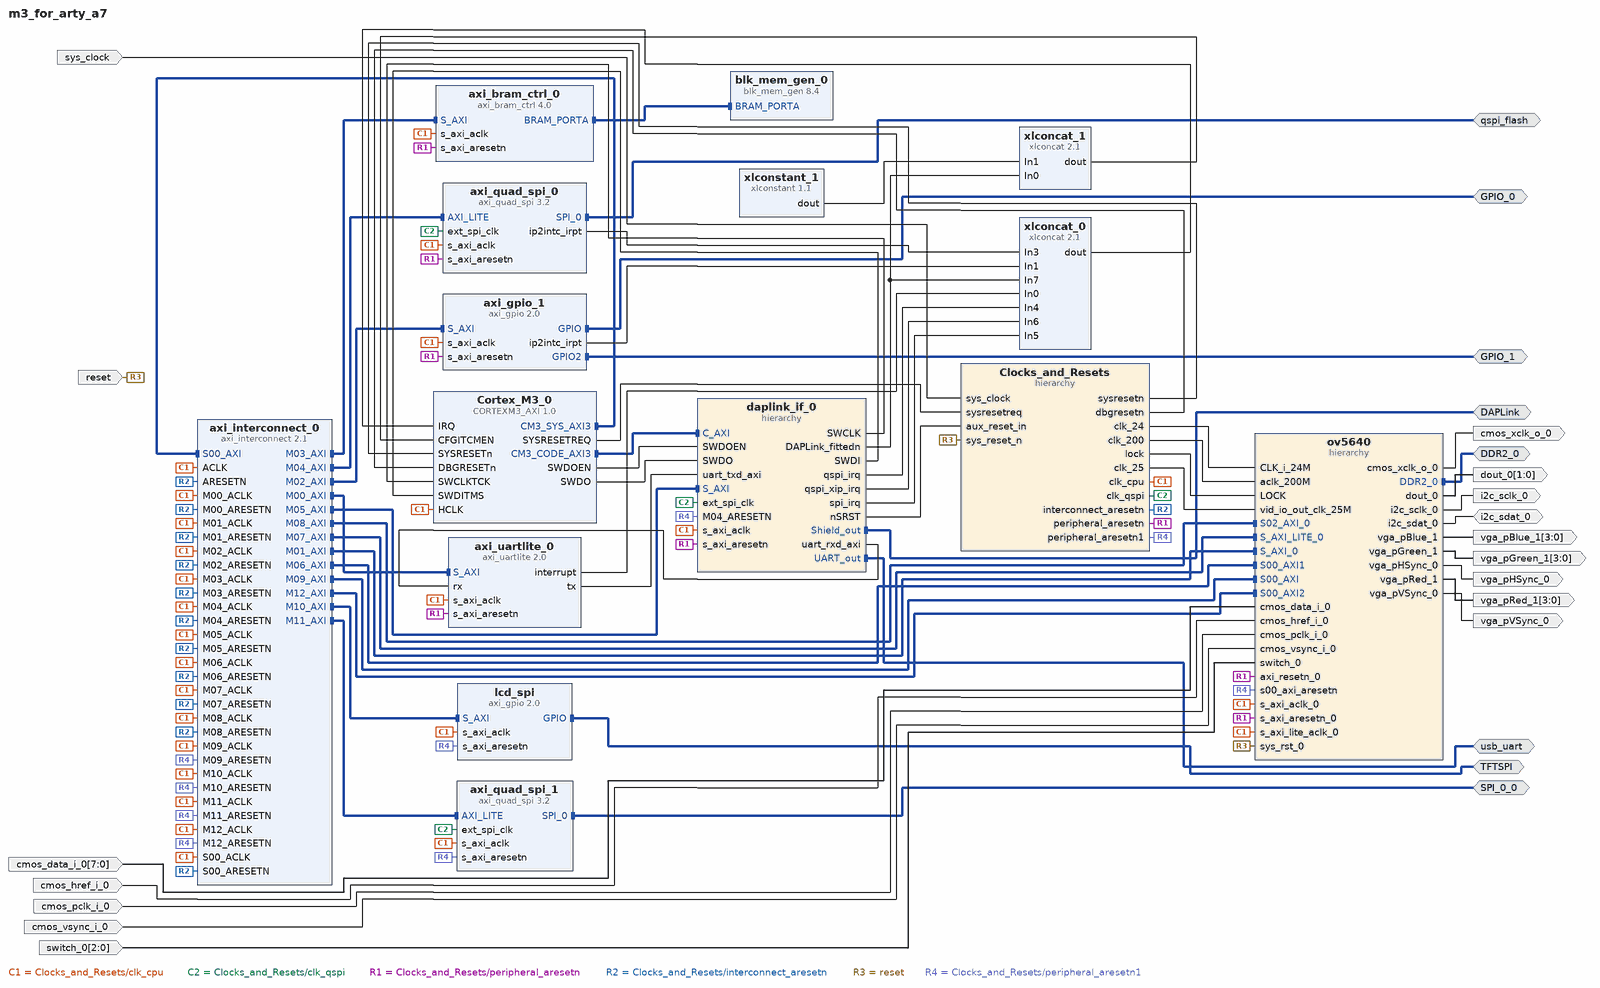
[diagram p0: block diagram of the top level]
# Vivado block design m3_for_arty_a7, xc7a100tcsg324-1, Vivado 2018.2
create_bd_design m3_for_arty_a7

create_bd_intf_port -mode Master -vlnv xilinx.com:interface:gpio_rtl:1.0 DAPLink
create_bd_intf_port -mode Master -vlnv xilinx.com:interface:spi_rtl:1.0 qspi_flash
create_bd_intf_port -mode Master -vlnv xilinx.com:interface:uart_rtl:1.0 usb_uart
create_bd_intf_port -mode Master -vlnv xilinx.com:interface:ddrx_rtl:1.0 DDR2_0
create_bd_intf_port -mode Master -vlnv xilinx.com:interface:gpio_rtl:1.0 GPIO_0
create_bd_intf_port -mode Master -vlnv xilinx.com:interface:gpio_rtl:1.0 GPIO_1
create_bd_intf_port -mode Master -vlnv xilinx.com:interface:gpio_rtl:1.0 TFTSPI
create_bd_intf_port -mode Master -vlnv xilinx.com:interface:spi_rtl:1.0 SPI_0_0
create_bd_port -dir I -type clk sys_clock
set_property -dict {CONFIG.FREQ_HZ 100000000 CONFIG.PHASE 0.000} [get_bd_ports sys_clock]
create_bd_port -dir I -type rst reset
set_property -dict {CONFIG.POLARITY ACTIVE_LOW} [get_bd_ports reset]
create_bd_port -dir O cmos_xclk_o_0
create_bd_port -dir I -from 7 -to 0 cmos_data_i_0
create_bd_port -dir I cmos_href_i_0
create_bd_port -dir I cmos_pclk_i_0
create_bd_port -dir I cmos_vsync_i_0
create_bd_port -dir O vga_pHSync_0
create_bd_port -dir O vga_pVSync_0
create_bd_port -dir O -from 3 -to 0 vga_pRed_1
create_bd_port -dir O -from 3 -to 0 vga_pGreen_1
create_bd_port -dir O -from 3 -to 0 vga_pBlue_1
create_bd_port -dir O -from 1 -to 0 dout_0
create_bd_port -dir O i2c_sclk_0
create_bd_port -dir IO i2c_sdat_0
create_bd_port -dir I -from 2 -to 0 switch_0

create_bd_cell -type hier Clocks_and_Resets
create_bd_cell -type ip -vlnv xilinx.com:ip:axi_bram_ctrl:4.0 axi_bram_ctrl_0
set_property -dict {CONFIG.PROTOCOL AXI4LITE CONFIG.SINGLE_PORT_BRAM 1 CONFIG.C_SELECT_XPM 0} [get_bd_cells axi_bram_ctrl_0]
create_bd_cell -type ip -vlnv xilinx.com:ip:axi_gpio:2.0 axi_gpio_1
set_property -dict [list \
  CONFIG.C_GPIO_WIDTH 8 \
  CONFIG.C_GPIO2_WIDTH 8 \
  CONFIG.C_IS_DUAL 1 \
  CONFIG.C_ALL_INPUTS_2 1 \
  CONFIG.C_INTERRUPT_PRESENT 1 \
  CONFIG.USE_BOARD_FLOW true \
  CONFIG.GPIO_BOARD_INTERFACE Custom \
  CONFIG.GPIO2_BOARD_INTERFACE Custom \
  CONFIG.C_ALL_OUTPUTS 1 \
] [get_bd_cells axi_gpio_1]
create_bd_cell -type ip -vlnv xilinx.com:ip:axi_interconnect:2.1 axi_interconnect_0
set_property -dict [list \
  CONFIG.NUM_SI 1 \
  CONFIG.NUM_MI 13 \
  CONFIG.ENABLE_ADVANCED_OPTIONS 1 \
  CONFIG.SYNCHRONIZATION_STAGES 2 \
  CONFIG.M00_HAS_REGSLICE 0 \
  CONFIG.M01_HAS_REGSLICE 3 \
  CONFIG.M02_HAS_REGSLICE 3 \
  CONFIG.M03_HAS_REGSLICE 3 \
  CONFIG.M04_HAS_REGSLICE 3 \
  CONFIG.M05_HAS_REGSLICE 3 \
  CONFIG.M00_HAS_DATA_FIFO 0 \
  CONFIG.M01_HAS_DATA_FIFO 0 \
  CONFIG.S00_HAS_REGSLICE 3 \
  CONFIG.S01_HAS_REGSLICE 3 \
  CONFIG.S01_HAS_DATA_FIFO 1 \
  CONFIG.M00_SECURE 0 \
  CONFIG.M01_SECURE 0 \
  CONFIG.M02_SECURE 0 \
] [get_bd_cells axi_interconnect_0]
create_bd_cell -type ip -vlnv xilinx.com:ip:axi_quad_spi:3.2 axi_quad_spi_0
set_property -dict [list \
  CONFIG.C_FIFO_DEPTH 16 \
  CONFIG.USE_BOARD_FLOW true \
  CONFIG.QSPI_BOARD_INTERFACE qspi_flash \
] [get_bd_cells axi_quad_spi_0]
create_bd_cell -type ip -vlnv xilinx.com:ip:axi_uartlite:2.0 axi_uartlite_0
set_property -dict [list \
  CONFIG.C_BAUDRATE 115200 \
  CONFIG.C_S_AXI_ACLK_FREQ_HZ 50000000 \
  CONFIG.USE_BOARD_FLOW true \
  CONFIG.UARTLITE_BOARD_INTERFACE Custom \
] [get_bd_cells axi_uartlite_0]
create_bd_cell -type ip -vlnv xilinx.com:ip:blk_mem_gen:8.4 blk_mem_gen_0
set_property -dict [list \
  CONFIG.Memory_Type Single_Port_RAM \
  CONFIG.Enable_32bit_Address true \
  CONFIG.Write_Width_A 32 \
  CONFIG.Read_Width_A 32 \
  CONFIG.Register_PortA_Output_of_Memory_Primitives false \
  CONFIG.Use_RSTA_Pin true \
  CONFIG.Port_A_Write_Rate 50 \
  CONFIG.Port_B_Clock 0 \
  CONFIG.Port_B_Write_Rate 0 \
  CONFIG.Port_B_Enable_Rate 0 \
  CONFIG.use_bram_block BRAM_Controller \
  CONFIG.EN_SAFETY_CKT true \
] [get_bd_cells blk_mem_gen_0]
create_bd_cell -type hier daplink_if_0
create_bd_cell -type ip -vlnv xilinx.com:ip:xlconcat:2.1 xlconcat_0
set_property -dict {CONFIG.NUM_PORTS 8} [get_bd_cells xlconcat_0]
create_bd_cell -type ip -vlnv xilinx.com:ip:xlconcat:2.1 xlconcat_1
set_property -dict {CONFIG.NUM_PORTS 2 CONFIG.IN6_WIDTH 25} [get_bd_cells xlconcat_1]
create_bd_cell -type ip -vlnv xilinx.com:ip:xlconstant:1.1 xlconstant_1
set_property -dict {CONFIG.CONST_WIDTH 1 CONFIG.CONST_VAL 1} [get_bd_cells xlconstant_1]
create_bd_cell -type ip -vlnv Arm.com:CortexM:CORTEXM3_AXI:1.0 Cortex_M3_0
set_property -dict [list \
  CONFIG.JTAG_PRESENT false \
  CONFIG.ITCM_SIZE {"0110"} \
  CONFIG.DTCM_SIZE {"0110"} \
  CONFIG.ITCM_INIT_FILE bram_a7.hex \
  CONFIG.TRACE_LVL 1 \
  CONFIG.DEBUG_LVL 2 \
  CONFIG.WIC_PRESENT false \
] [get_bd_cells Cortex_M3_0]
create_bd_cell -type hier ov5640
create_bd_cell -type ip -vlnv xilinx.com:ip:axi_gpio:2.0 lcd_spi
set_property -dict {CONFIG.C_GPIO_WIDTH 3 CONFIG.USE_BOARD_FLOW true CONFIG.GPIO_BOARD_INTERFACE Custom} [get_bd_cells lcd_spi]
create_bd_cell -type ip -vlnv xilinx.com:ip:axi_quad_spi:3.2 axi_quad_spi_1
set_property -dict [list \
  CONFIG.C_USE_STARTUP 0 \
  CONFIG.C_NUM_SS_BITS 2 \
  CONFIG.C_SCK_RATIO 16 \
  CONFIG.C_FIFO_DEPTH 16 \
  CONFIG.C_XIP_MODE 0 \
  CONFIG.C_TYPE_OF_AXI4_INTERFACE 0 \
  CONFIG.Master_mode 1 \
  CONFIG.FIFO_INCLUDED 1 \
] [get_bd_cells axi_quad_spi_1]

# ---- hierarchy /Clocks_and_Resets ----
current_bd_instance /Clocks_and_Resets
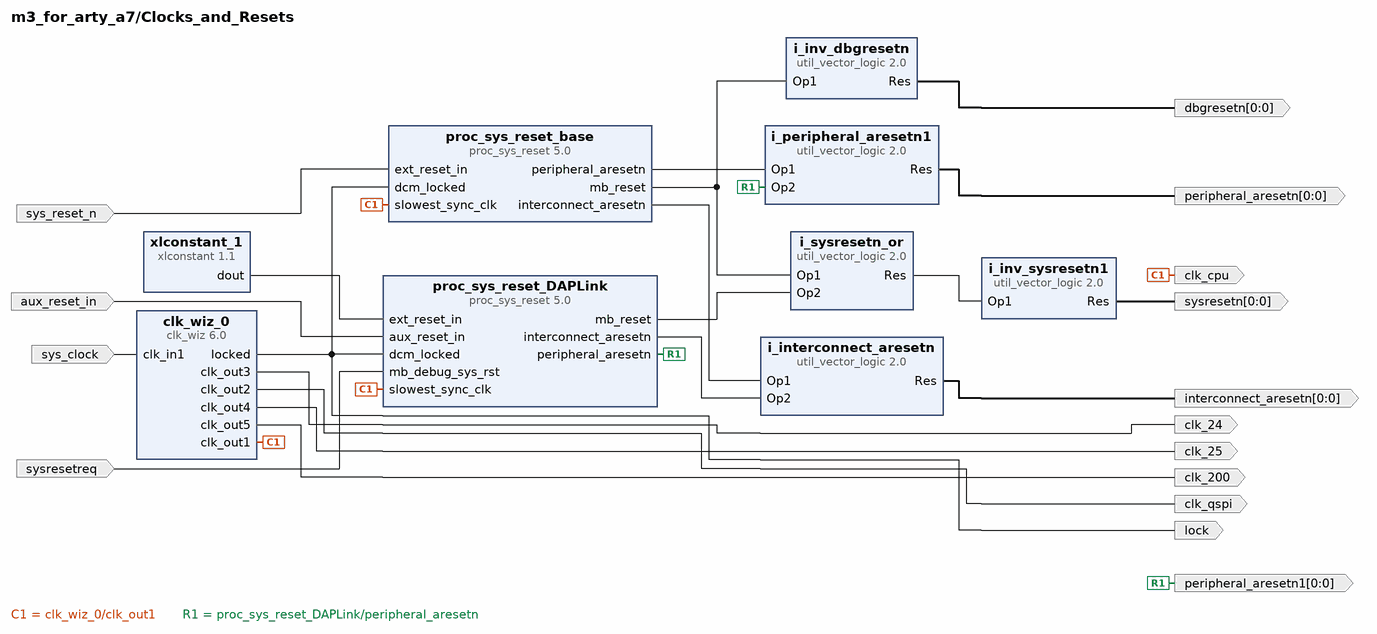
[diagram p1: block diagram inside /Clocks_and_Resets]
create_bd_pin -dir I -type rst aux_reset_in
create_bd_pin -dir O -from 0 -to 0 -type rst interconnect_aresetn
create_bd_pin -dir O -from 0 -to 0 -type rst peripheral_aresetn
create_bd_pin -dir O -type clk clk_cpu
create_bd_pin -dir I -type clk sys_clock
create_bd_pin -dir O -from 0 -to 0 sysresetn
create_bd_pin -dir O -from 0 -to 0 dbgresetn
create_bd_pin -dir O clk_qspi
create_bd_pin -dir I sysresetreq
create_bd_pin -dir I -type rst sys_reset_n
create_bd_pin -dir O -type clk clk_24
create_bd_pin -dir O -type clk clk_25
create_bd_pin -dir O -type clk clk_200
create_bd_pin -dir O lock
create_bd_pin -dir O -from 0 -to 0 -type rst peripheral_aresetn1

create_bd_cell -type ip -vlnv xilinx.com:ip:proc_sys_reset:5.0 proc_sys_reset_DAPLink
set_property -dict [list \
  CONFIG.C_AUX_RST_WIDTH 1 \
  CONFIG.C_EXT_RST_WIDTH 1 \
  CONFIG.USE_BOARD_FLOW true \
  CONFIG.RESET_BOARD_INTERFACE Custom \
] [get_bd_cells proc_sys_reset_DAPLink]
create_bd_cell -type ip -vlnv xilinx.com:ip:proc_sys_reset:5.0 proc_sys_reset_base
set_property -dict [list \
  CONFIG.C_AUX_RST_WIDTH 1 \
  CONFIG.C_EXT_RST_WIDTH 1 \
  CONFIG.USE_BOARD_FLOW true \
  CONFIG.RESET_BOARD_INTERFACE reset \
] [get_bd_cells proc_sys_reset_base]
create_bd_cell -type ip -vlnv xilinx.com:ip:util_vector_logic:2.0 i_interconnect_aresetn
set_property -dict {CONFIG.C_SIZE 1} [get_bd_cells i_interconnect_aresetn]
create_bd_cell -type ip -vlnv xilinx.com:ip:util_vector_logic:2.0 i_peripheral_aresetn1
set_property -dict {CONFIG.C_SIZE 1} [get_bd_cells i_peripheral_aresetn1]
create_bd_cell -type ip -vlnv xilinx.com:ip:util_vector_logic:2.0 i_sysresetn_or
set_property -dict {CONFIG.C_SIZE 1 CONFIG.C_OPERATION or} [get_bd_cells i_sysresetn_or]
create_bd_cell -type ip -vlnv xilinx.com:ip:util_vector_logic:2.0 i_inv_dbgresetn
set_property -dict {CONFIG.C_SIZE 1 CONFIG.C_OPERATION not} [get_bd_cells i_inv_dbgresetn]
create_bd_cell -type ip -vlnv xilinx.com:ip:util_vector_logic:2.0 i_inv_sysresetn1
set_property -dict {CONFIG.C_SIZE 1 CONFIG.C_OPERATION not} [get_bd_cells i_inv_sysresetn1]
create_bd_cell -type ip -vlnv xilinx.com:ip:clk_wiz:6.0 clk_wiz_0
set_property -dict [list \
  CONFIG.USE_INCLK_SWITCHOVER false \
  CONFIG.SECONDARY_SOURCE Single_ended_clock_capable_pin \
  CONFIG.CLKIN1_JITTER_PS 833.33 \
  CONFIG.CLKIN2_JITTER_PS 833.33 \
  CONFIG.CLKOUT2_USED true \
  CONFIG.CLKOUT3_USED true \
  CONFIG.CLKOUT4_USED true \
  CONFIG.CLKOUT5_USED true \
  CONFIG.NUM_OUT_CLKS 5 \
  CONFIG.CLKOUT1_REQUESTED_OUT_FREQ 50.0 \
  CONFIG.CLKOUT2_REQUESTED_OUT_FREQ 50.0 \
  CONFIG.CLKOUT3_REQUESTED_OUT_FREQ 24 \
  CONFIG.CLKOUT4_REQUESTED_OUT_FREQ 25 \
  CONFIG.CLKOUT5_REQUESTED_OUT_FREQ 200 \
  CONFIG.CLKOUT1_DRIVES BUFGCE \
  CONFIG.CLKOUT2_DRIVES BUFGCE \
  CONFIG.CLKOUT3_DRIVES BUFGCE \
  CONFIG.CLKOUT4_DRIVES BUFGCE \
  CONFIG.CLKOUT5_DRIVES BUFGCE \
  CONFIG.CLKOUT6_DRIVES BUFGCE \
  CONFIG.CLKOUT7_DRIVES BUFGCE \
  CONFIG.FEEDBACK_SOURCE FDBK_AUTO \
  CONFIG.USE_RESET false \
  CONFIG.MMCM_DIVCLK_DIVIDE 1 \
  CONFIG.MMCM_CLKFBOUT_MULT_F 6.000 \
  CONFIG.MMCM_CLKIN1_PERIOD 10.0 \
  CONFIG.MMCM_CLKIN2_PERIOD 10.0 \
  CONFIG.MMCM_CLKOUT0_DIVIDE_F 12.000 \
  CONFIG.MMCM_CLKOUT1_DIVIDE 12 \
  CONFIG.MMCM_CLKOUT2_DIVIDE 25 \
  CONFIG.MMCM_CLKOUT3_DIVIDE 24 \
  CONFIG.MMCM_CLKOUT4_DIVIDE 3 \
  CONFIG.USE_SAFE_CLOCK_STARTUP true \
  CONFIG.USE_BOARD_FLOW true \
  CONFIG.CLK_IN1_BOARD_INTERFACE sys_clock \
  CONFIG.CLK_IN2_BOARD_INTERFACE Custom \
  CONFIG.RESET_BOARD_INTERFACE Custom \
  CONFIG.CLKOUT1_JITTER 174.353 \
  CONFIG.CLKOUT1_PHASE_ERROR 132.063 \
  CONFIG.CLKOUT2_JITTER 174.353 \
  CONFIG.CLKOUT2_PHASE_ERROR 132.063 \
  CONFIG.CLKOUT3_JITTER 202.114 \
  CONFIG.CLKOUT3_PHASE_ERROR 132.063 \
  CONFIG.CLKOUT4_JITTER 200.470 \
  CONFIG.CLKOUT4_PHASE_ERROR 132.063 \
  CONFIG.CLKOUT5_JITTER 132.221 \
  CONFIG.CLKOUT5_PHASE_ERROR 132.063 \
] [get_bd_cells clk_wiz_0]
create_bd_cell -type ip -vlnv xilinx.com:ip:xlconstant:1.1 xlconstant_1

# ---- hierarchy /daplink_if_0 ----
current_bd_instance /daplink_if_0
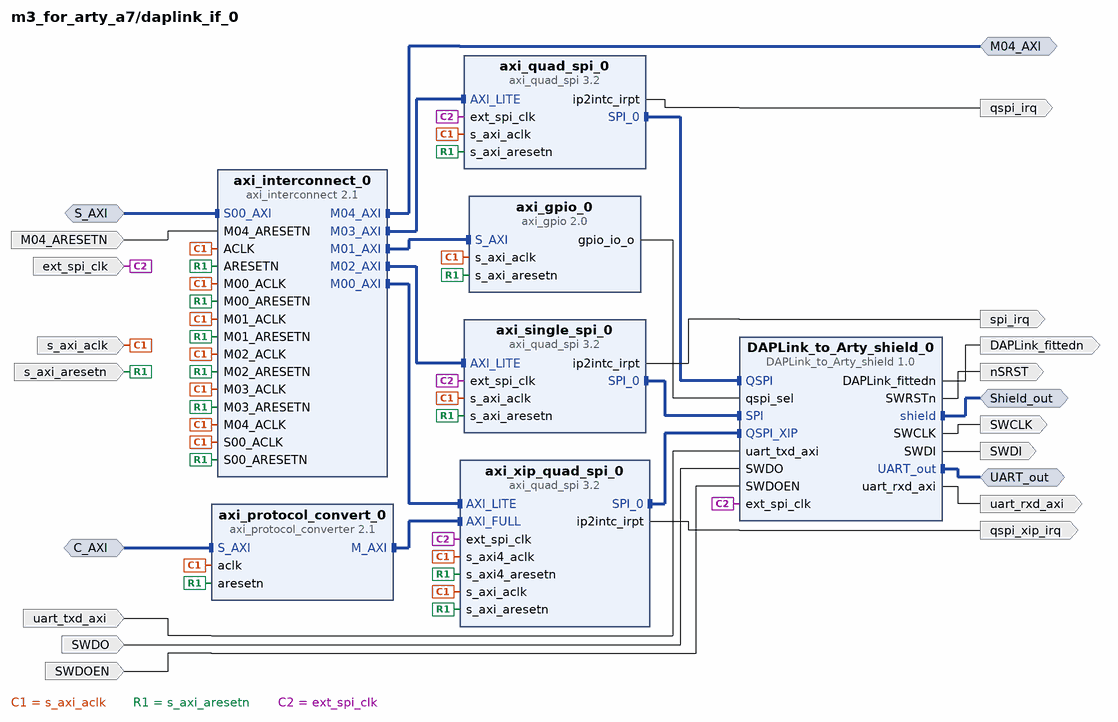
[diagram p2: block diagram inside /daplink_if_0]
create_bd_intf_pin -mode Slave -vlnv xilinx.com:interface:aximm_rtl:1.0 S_AXI
create_bd_intf_pin -mode Master -vlnv xilinx.com:interface:uart_rtl:1.0 UART_out
create_bd_intf_pin -mode Master -vlnv xilinx.com:interface:gpio_rtl:1.0 Shield_out
create_bd_intf_pin -mode Slave -vlnv xilinx.com:interface:aximm_rtl:1.0 C_AXI
create_bd_intf_pin -mode Master -vlnv xilinx.com:interface:aximm_rtl:1.0 M04_AXI
create_bd_pin -dir I s_axi_aclk
create_bd_pin -dir I s_axi_aresetn
create_bd_pin -dir O DAPLink_fittedn
create_bd_pin -dir O qspi_irq
create_bd_pin -dir I ext_spi_clk
create_bd_pin -dir O uart_rxd_axi
create_bd_pin -dir O SWDI
create_bd_pin -dir O SWCLK
create_bd_pin -dir O nSRST
create_bd_pin -dir I SWDOEN
create_bd_pin -dir I SWDO
create_bd_pin -dir I uart_txd_axi
create_bd_pin -dir O spi_irq
create_bd_pin -dir O qspi_xip_irq
create_bd_pin -dir I -type rst M04_ARESETN

create_bd_cell -type ip -vlnv xilinx.com:ip:axi_interconnect:2.1 axi_interconnect_0
set_property -dict {CONFIG.NUM_MI 5} [get_bd_cells axi_interconnect_0]
create_bd_cell -type ip -vlnv xilinx.com:ip:axi_quad_spi:3.2 axi_single_spi_0
set_property -dict {CONFIG.C_USE_STARTUP 0 CONFIG.C_FIFO_DEPTH 16} [get_bd_cells axi_single_spi_0]
create_bd_cell -type ip -vlnv xilinx.com:ip:axi_quad_spi:3.2 axi_quad_spi_0
set_property -dict {CONFIG.C_USE_STARTUP 0 CONFIG.C_SPI_MODE 2 CONFIG.C_FIFO_DEPTH 16} [get_bd_cells axi_quad_spi_0]
create_bd_cell -type ip -vlnv xilinx.com:ip:axi_quad_spi:3.2 axi_xip_quad_spi_0
set_property -dict [list \
  CONFIG.C_SPI_MEMORY 3 \
  CONFIG.C_USE_STARTUP 0 \
  CONFIG.C_SPI_MODE 2 \
  CONFIG.C_XIP_MODE 1 \
  CONFIG.C_SPI_MEM_ADDR_BITS 24 \
  CONFIG.C_TYPE_OF_AXI4_INTERFACE 1 \
] [get_bd_cells axi_xip_quad_spi_0]
create_bd_cell -type ip -vlnv xilinx.com:ip:axi_gpio:2.0 axi_gpio_0
create_bd_cell -type ip -vlnv xilinx.com:ip:axi_protocol_converter:2.1 axi_protocol_convert_0
create_bd_cell -type ip -vlnv Arm.com:user:DAPLink_to_Arty_shield:1.0 DAPLink_to_Arty_shield_0

# ---- hierarchy /ov5640 ----
current_bd_instance /ov5640
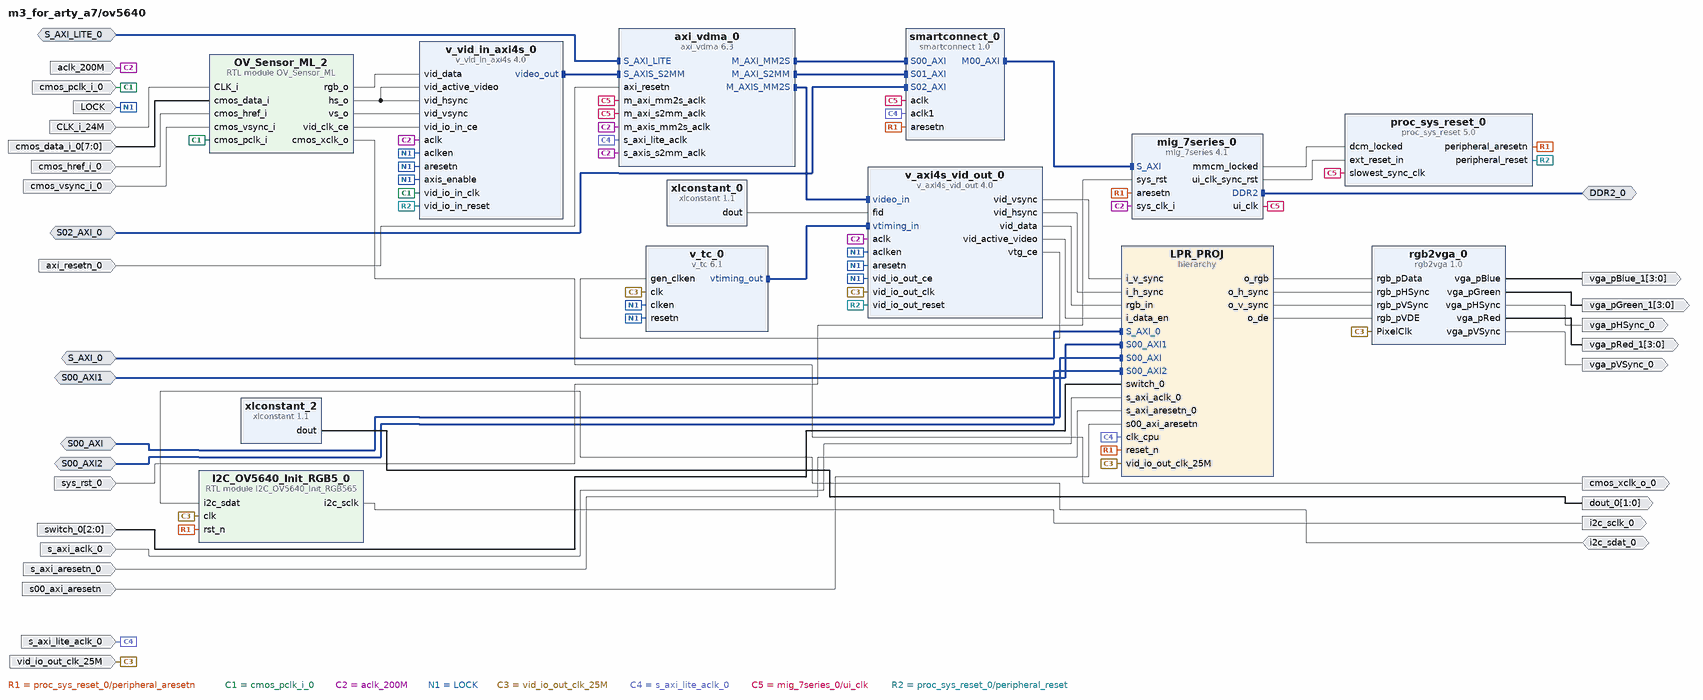
[diagram p3: block diagram inside /ov5640]
create_bd_intf_pin -mode Slave -vlnv xilinx.com:interface:aximm_rtl:1.0 S_AXI_LITE_0
create_bd_intf_pin -mode Master -vlnv xilinx.com:interface:ddrx_rtl:1.0 DDR2_0
create_bd_intf_pin -mode Slave -vlnv xilinx.com:interface:aximm_rtl:1.0 S02_AXI_0
create_bd_intf_pin -mode Slave -vlnv xilinx.com:interface:aximm_rtl:1.0 S_AXI_0
create_bd_intf_pin -mode Slave -vlnv xilinx.com:interface:aximm_rtl:1.0 S00_AXI1
create_bd_intf_pin -mode Slave -vlnv xilinx.com:interface:aximm_rtl:1.0 S00_AXI
create_bd_intf_pin -mode Slave -vlnv xilinx.com:interface:aximm_rtl:1.0 S00_AXI2
create_bd_pin -dir O cmos_xclk_o_0
create_bd_pin -dir I CLK_i_24M
create_bd_pin -dir I -from 7 -to 0 cmos_data_i_0
create_bd_pin -dir I cmos_href_i_0
create_bd_pin -dir I cmos_pclk_i_0
create_bd_pin -dir I cmos_vsync_i_0
create_bd_pin -dir I LOCK
create_bd_pin -dir I -type clk aclk_200M
create_bd_pin -dir I -type rst axi_resetn_0
create_bd_pin -dir I -type clk vid_io_out_clk_25M
create_bd_pin -dir I -type clk s_axi_lite_aclk_0
create_bd_pin -dir O vga_pHSync_0
create_bd_pin -dir O vga_pVSync_0
create_bd_pin -dir O -from 3 -to 0 vga_pRed_1
create_bd_pin -dir O -from 3 -to 0 vga_pGreen_1
create_bd_pin -dir O -from 3 -to 0 vga_pBlue_1
create_bd_pin -dir O -from 1 -to 0 dout_0
create_bd_pin -dir I -type rst sys_rst_0
create_bd_pin -dir O i2c_sclk_0
create_bd_pin -dir IO i2c_sdat_0
create_bd_pin -dir I -from 2 -to 0 switch_0
create_bd_pin -dir I -type clk s_axi_aclk_0
create_bd_pin -dir I -type rst s_axi_aresetn_0
create_bd_pin -dir I -type rst s00_axi_aresetn

create_bd_cell -type ip -vlnv xilinx.com:ip:v_vid_in_axi4s:4.0 v_vid_in_axi4s_0
set_property -dict {CONFIG.C_HAS_ASYNC_CLK 1} [get_bd_cells v_vid_in_axi4s_0]
create_bd_cell -type ip -vlnv xilinx.com:ip:v_axi4s_vid_out:4.0 v_axi4s_vid_out_0
set_property -dict {CONFIG.C_HAS_ASYNC_CLK 1} [get_bd_cells v_axi4s_vid_out_0]
create_bd_cell -type ip -vlnv xilinx.com:ip:axi_vdma:6.3 axi_vdma_0
set_property -dict {CONFIG.c_m_axis_mm2s_tdata_width 24} [get_bd_cells axi_vdma_0]
create_bd_cell -type ip -vlnv xilinx.com:ip:v_tc:6.1 v_tc_0
set_property -dict [list \
  CONFIG.HAS_AXI4_LITE false \
  CONFIG.HAS_INTC_IF false \
  CONFIG.VIDEO_MODE 640x480p \
  CONFIG.enable_detection false \
  CONFIG.enable_generation true \
] [get_bd_cells v_tc_0]
create_bd_cell -type ip -vlnv xilinx.com:ip:xlconstant:1.1 xlconstant_0
set_property -dict {CONFIG.CONST_VAL 0} [get_bd_cells xlconstant_0]
create_bd_cell -type ip -vlnv xilinx.com:ip:proc_sys_reset:5.0 proc_sys_reset_0
create_bd_cell -type ip -vlnv digilentinc.com:ip:rgb2vga:1.0 rgb2vga_0
set_property -dict [list \
  CONFIG.kBlueDepth 4 \
  CONFIG.kGreenDepth 4 \
  CONFIG.kRedDepth 4 \
  CONFIG.VID_IN_DATA_WIDTH 24 \
] [get_bd_cells rgb2vga_0]
create_bd_cell -type ip -vlnv xilinx.com:ip:mig_7series:4.1 mig_7series_0
set_property -dict [list \
  CONFIG.XML_INPUT_FILE mig_a.prj \
  CONFIG.RESET_BOARD_INTERFACE Custom \
  CONFIG.MIG_DONT_TOUCH_PARAM Custom \
  CONFIG.BOARD_MIG_PARAM Custom \
] [get_bd_cells mig_7series_0]
create_bd_cell -type ip -vlnv xilinx.com:ip:xlconstant:1.1 xlconstant_2
set_property -dict {CONFIG.CONST_WIDTH 2 CONFIG.CONST_VAL 2} [get_bd_cells xlconstant_2]
create_bd_cell -type module -reference OV_Sensor_ML OV_Sensor_ML_2
create_bd_cell -type module -reference I2C_OV5640_Init_RGB565 I2C_OV5640_Init_RGB5_0
set_property -dict {CONFIG.CLK_Freq 250000000} [get_bd_cells I2C_OV5640_Init_RGB5_0]
create_bd_cell -type hier LPR_PROJ
create_bd_cell -type ip -vlnv xilinx.com:ip:smartconnect:1.0 smartconnect_0
set_property -dict {CONFIG.NUM_SI 3 CONFIG.NUM_CLKS 2 CONFIG.HAS_ARESETN 1} [get_bd_cells smartconnect_0]

# ---- hierarchy /ov5640/LPR_PROJ ----
current_bd_instance /ov5640/LPR_PROJ
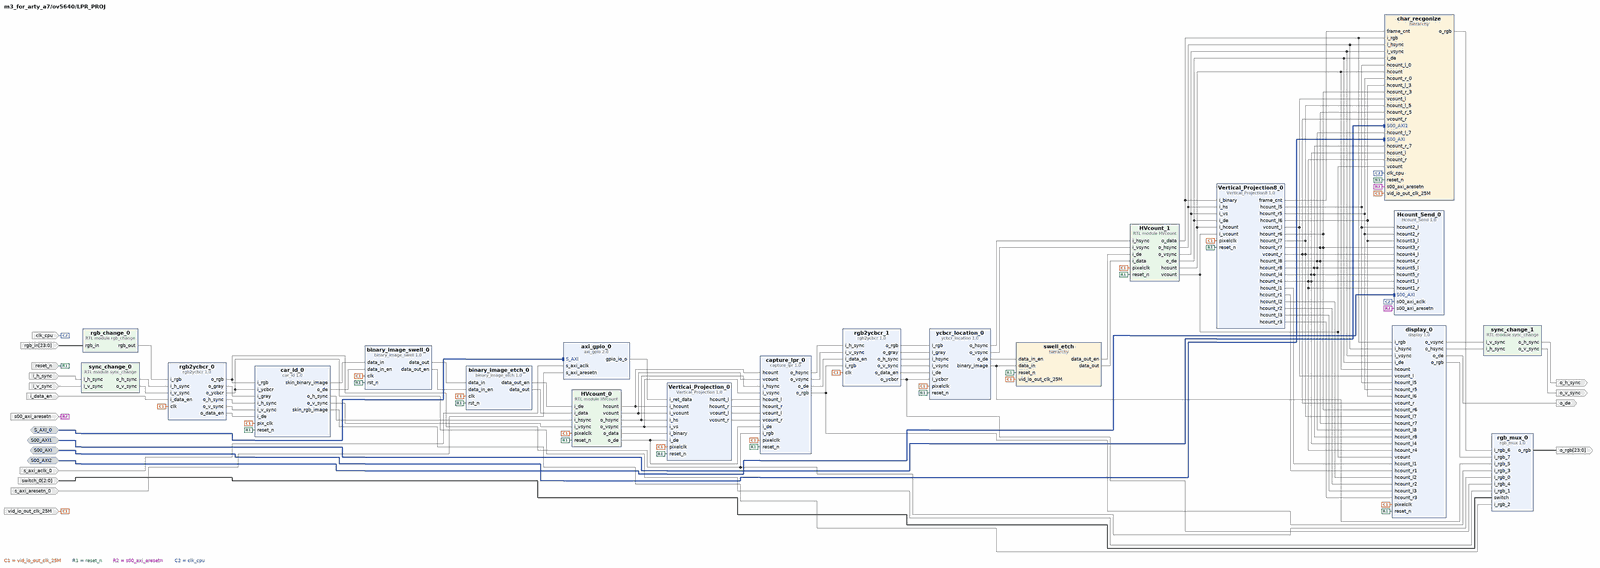
[diagram p4: block diagram inside /ov5640/LPR_PROJ, whole]
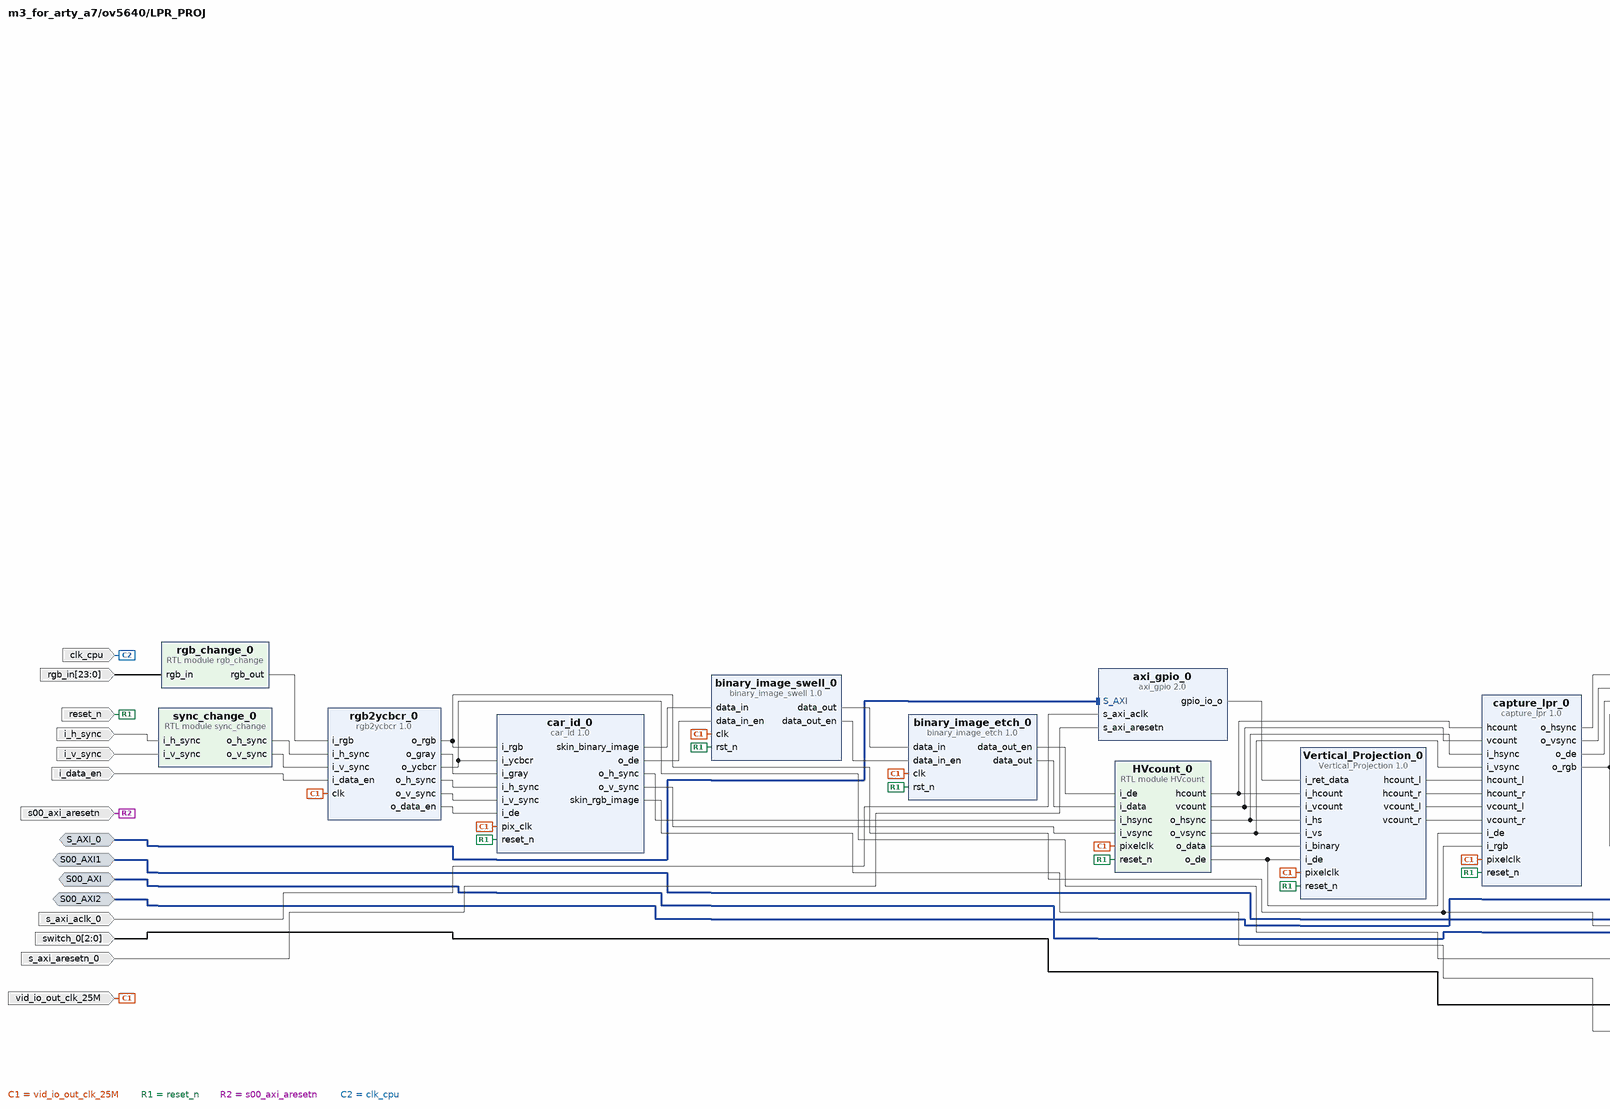
[diagram p5: block diagram inside /ov5640/LPR_PROJ, left part]
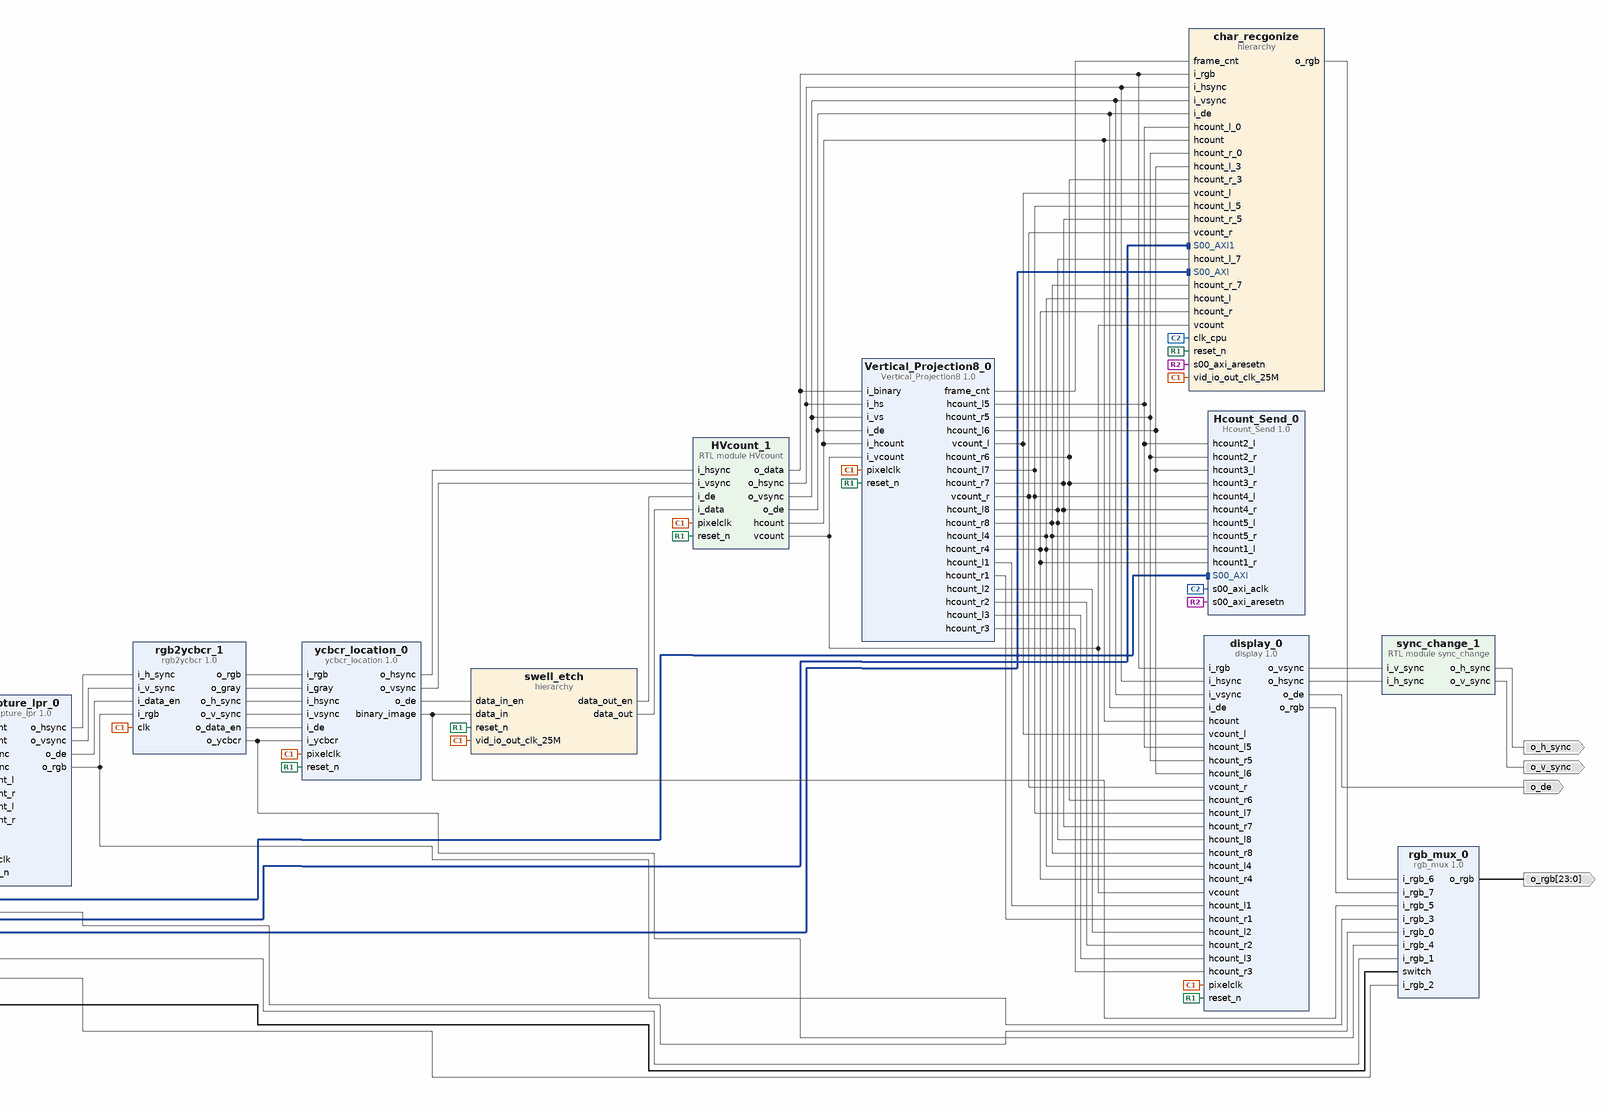
[diagram p6: block diagram inside /ov5640/LPR_PROJ, right part]
create_bd_intf_pin -mode Slave -vlnv xilinx.com:interface:aximm_rtl:1.0 S_AXI_0
create_bd_intf_pin -mode Slave -vlnv xilinx.com:interface:aximm_rtl:1.0 S00_AXI1
create_bd_intf_pin -mode Slave -vlnv xilinx.com:interface:aximm_rtl:1.0 S00_AXI
create_bd_intf_pin -mode Slave -vlnv xilinx.com:interface:aximm_rtl:1.0 S00_AXI2
create_bd_pin -dir I i_data_en
create_bd_pin -dir I -from 23 -to 0 rgb_in
create_bd_pin -dir I i_h_sync
create_bd_pin -dir I i_v_sync
create_bd_pin -dir O -from 23 -to 0 o_rgb
create_bd_pin -dir O o_h_sync
create_bd_pin -dir O o_v_sync
create_bd_pin -dir O o_de
create_bd_pin -dir I vid_io_out_clk_25M
create_bd_pin -dir I -type rst reset_n
create_bd_pin -dir I -from 2 -to 0 switch_0
create_bd_pin -dir I -type clk s_axi_aclk_0
create_bd_pin -dir I -type rst s_axi_aresetn_0
create_bd_pin -dir I -type clk clk_cpu
create_bd_pin -dir I -type rst s00_axi_aresetn

create_bd_cell -type module -reference rgb_change rgb_change_0
create_bd_cell -type module -reference sync_change sync_change_0
create_bd_cell -type module -reference HVcount HVcount_0
create_bd_cell -type ip -vlnv xilinx.com:user:rgb2ycbcr:1.0 rgb2ycbcr_0
create_bd_cell -type ip -vlnv xilinx.com:user:car_id:1.0 car_id_0
set_property -dict [list \
  CONFIG.CB_LOW {"01011010"} \
  CONFIG.CB_HIGH {"11100110"} \
  CONFIG.CR_LOW 00000100 \
  CONFIG.CR_HIGH {"10101010"} \
] [get_bd_cells car_id_0]
create_bd_cell -type ip -vlnv xilinx.com:user:capture_lpr:1.0 capture_lpr_0
create_bd_cell -type ip -vlnv xilinx.com:user:rgb2ycbcr:1.0 rgb2ycbcr_1
create_bd_cell -type ip -vlnv xilinx.com:user:ycbcr_location:1.0 ycbcr_location_0
set_property -dict {CONFIG.CB_LOW 100 CONFIG.CB_HIGH 220 CONFIG.CR_LOW 100 CONFIG.CR_HIGH 165} [get_bd_cells ycbcr_location_0]
create_bd_cell -type ip -vlnv xilinx.com:user:display:1.0 display_0
create_bd_cell -type ip -vlnv xilinx.com:user:rgb_mux:1.0 rgb_mux_0
create_bd_cell -type module -reference sync_change sync_change_1
create_bd_cell -type ip -vlnv xilinx.com:ip:axi_gpio:2.0 axi_gpio_0
set_property -dict {CONFIG.C_IS_DUAL 0 CONFIG.C_ALL_OUTPUTS 1} [get_bd_cells axi_gpio_0]
create_bd_cell -type ip -vlnv xilinx.com:user:Vertical_Projection8:1.0 Vertical_Projection8_0
create_bd_cell -type hier char_recgonize
create_bd_cell -type module -reference HVcount HVcount_1
create_bd_cell -type hier swell_etch
create_bd_cell -type ip -vlnv xilinx.com:user:Hcount_Send:1.0 Hcount_Send_0
create_bd_cell -type ip -vlnv xilinx.com:user:binary_image_swell:1.0 binary_image_swell_0
create_bd_cell -type ip -vlnv xilinx.com:user:binary_image_etch:1.0 binary_image_etch_0
create_bd_cell -type ip -vlnv xilinx.com:user:Vertical_Projection:1.0 Vertical_Projection_0

# ---- hierarchy /ov5640/LPR_PROJ/char_recgonize ----
current_bd_instance /ov5640/LPR_PROJ/char_recgonize
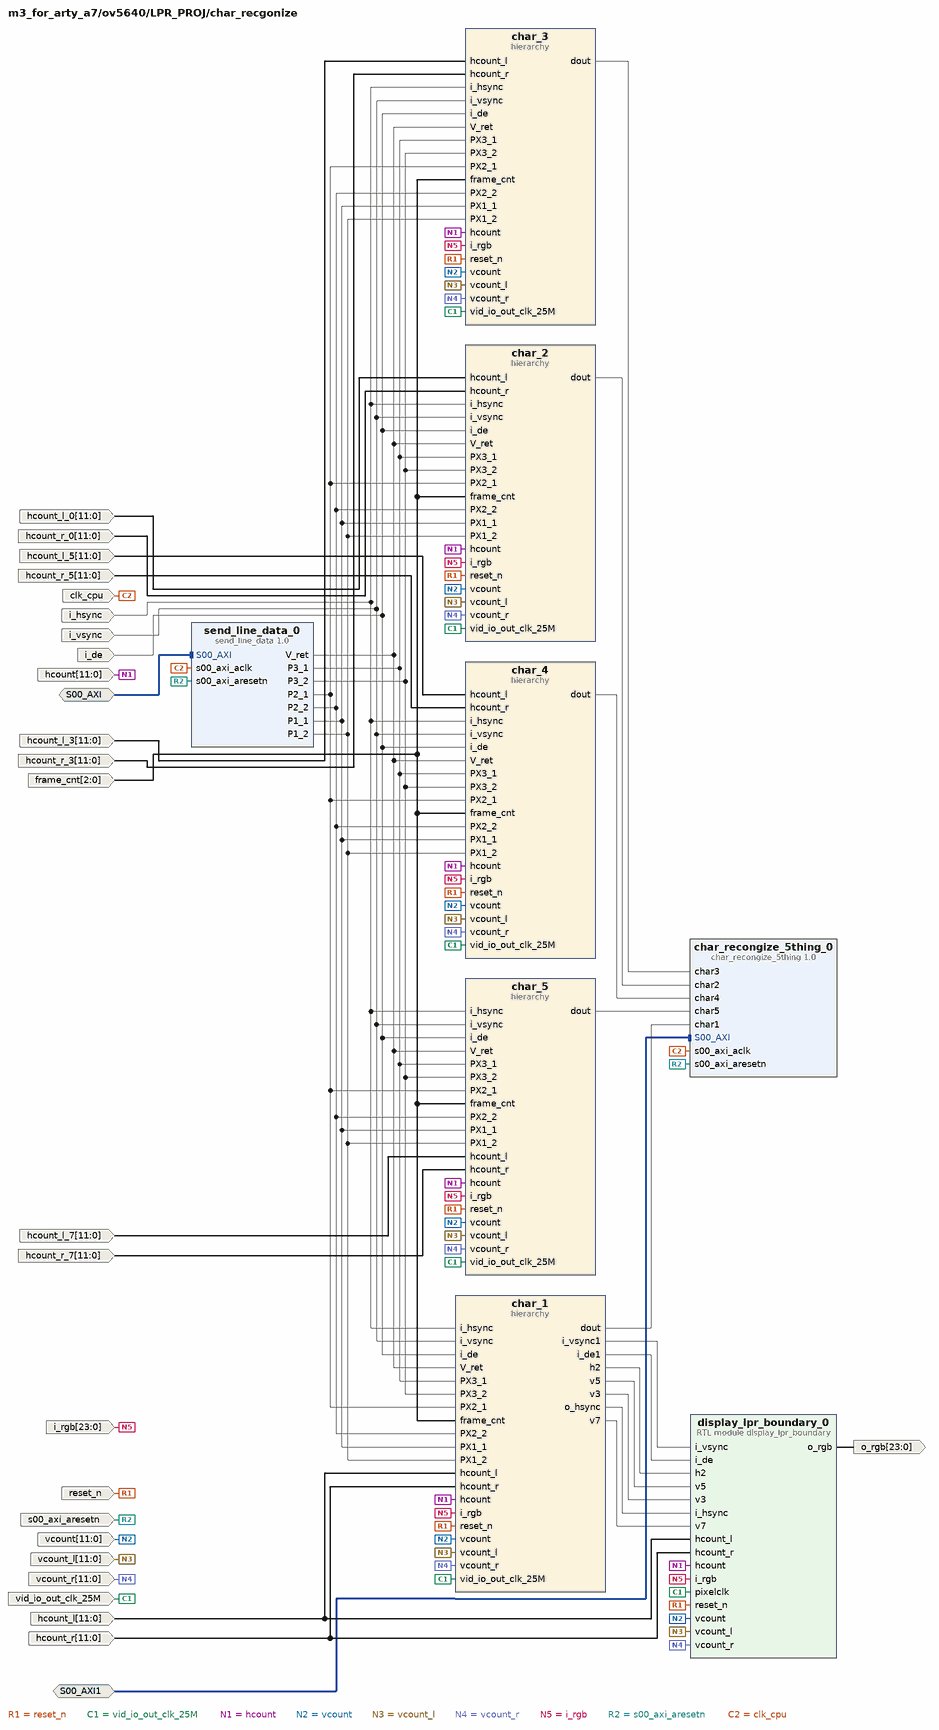
[diagram p7: block diagram inside /ov5640/LPR_PROJ/char_recgonize]
create_bd_intf_pin -mode Slave -vlnv xilinx.com:interface:aximm_rtl:1.0 S00_AXI1
create_bd_intf_pin -mode Slave -vlnv xilinx.com:interface:aximm_rtl:1.0 S00_AXI
create_bd_pin -dir I vid_io_out_clk_25M
create_bd_pin -dir I -type rst reset_n
create_bd_pin -dir I -from 23 -to 0 i_rgb
create_bd_pin -dir I -from 2 -to 0 frame_cnt
create_bd_pin -dir I i_hsync
create_bd_pin -dir I i_vsync
create_bd_pin -dir I i_de
create_bd_pin -dir I -from 11 -to 0 hcount
create_bd_pin -dir I -from 11 -to 0 vcount
create_bd_pin -dir I -from 11 -to 0 hcount_l
create_bd_pin -dir I -from 11 -to 0 hcount_r
create_bd_pin -dir I -from 11 -to 0 vcount_l
create_bd_pin -dir I -from 11 -to 0 vcount_r
create_bd_pin -dir I -type rst s00_axi_aresetn
create_bd_pin -dir I -type clk clk_cpu
create_bd_pin -dir O -from 23 -to 0 o_rgb
create_bd_pin -dir I -from 11 -to 0 hcount_l_0
create_bd_pin -dir I -from 11 -to 0 hcount_r_0
create_bd_pin -dir I -from 11 -to 0 hcount_l_3
create_bd_pin -dir I -from 11 -to 0 hcount_r_3
create_bd_pin -dir I -from 11 -to 0 hcount_l_5
create_bd_pin -dir I -from 11 -to 0 hcount_r_5
create_bd_pin -dir I -from 11 -to 0 hcount_l_7
create_bd_pin -dir I -from 11 -to 0 hcount_r_7

create_bd_cell -type hier char_1
create_bd_cell -type hier char_2
create_bd_cell -type hier char_3
create_bd_cell -type hier char_4
create_bd_cell -type hier char_5
create_bd_cell -type ip -vlnv xilinx.com:user:send_line_data:1.0 send_line_data_0
create_bd_cell -type ip -vlnv xilinx.com:user:char_recongize_5thing:1.0 char_recongize_5thing_0
create_bd_cell -type module -reference display_lpr_boundary display_lpr_boundary_0

# ---- hierarchy /ov5640/LPR_PROJ/char_recgonize/char_1 ----
current_bd_instance /ov5640/LPR_PROJ/char_recgonize/char_1
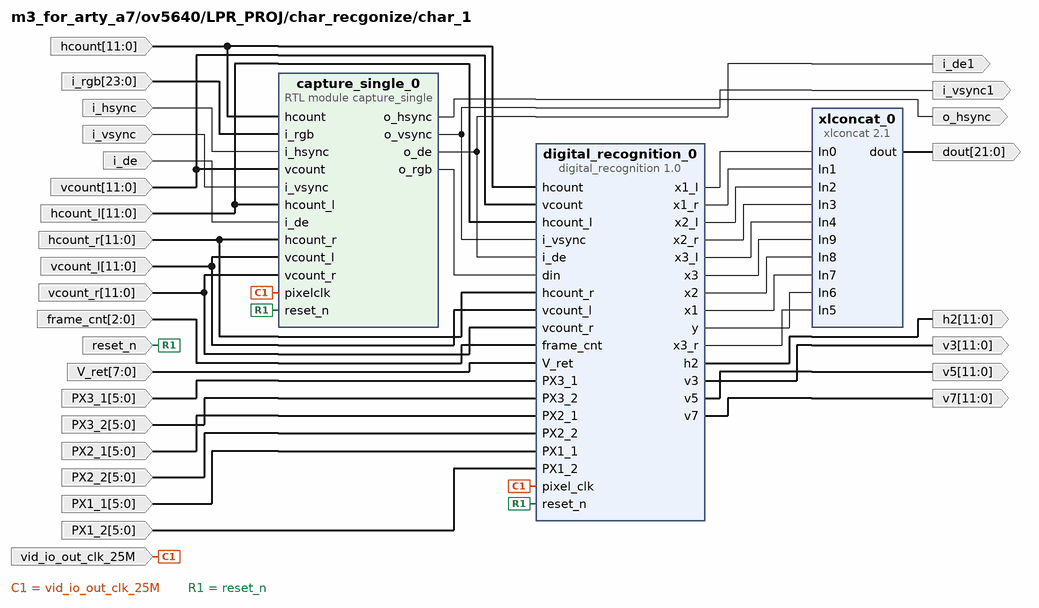
[diagram p8: block diagram inside /ov5640/LPR_PROJ/char_recgonize/char_1]
create_bd_pin -dir I -type clk vid_io_out_clk_25M
create_bd_pin -dir I -type rst reset_n
create_bd_pin -dir I -from 23 -to 0 i_rgb
create_bd_pin -dir I i_hsync
create_bd_pin -dir I i_vsync
create_bd_pin -dir I i_de
create_bd_pin -dir I -from 11 -to 0 hcount
create_bd_pin -dir I -from 11 -to 0 vcount
create_bd_pin -dir I -from 11 -to 0 hcount_l
create_bd_pin -dir I -from 11 -to 0 hcount_r
create_bd_pin -dir I -from 11 -to 0 vcount_l
create_bd_pin -dir I -from 11 -to 0 vcount_r
create_bd_pin -dir O o_hsync
create_bd_pin -dir O i_vsync1
create_bd_pin -dir O i_de1
create_bd_pin -dir I -from 2 -to 0 frame_cnt
create_bd_pin -dir O -from 11 -to 0 h2
create_bd_pin -dir O -from 11 -to 0 v5
create_bd_pin -dir O -from 11 -to 0 v3
create_bd_pin -dir I -from 7 -to 0 V_ret
create_bd_pin -dir I -from 5 -to 0 PX3_1
create_bd_pin -dir I -from 5 -to 0 PX3_2
create_bd_pin -dir I -from 5 -to 0 PX2_1
create_bd_pin -dir I -from 5 -to 0 PX2_2
create_bd_pin -dir I -from 5 -to 0 PX1_1
create_bd_pin -dir I -from 5 -to 0 PX1_2
create_bd_pin -dir O -from 11 -to 0 v7
create_bd_pin -dir O -from 21 -to 0 dout

create_bd_cell -type module -reference capture_single capture_single_0
create_bd_cell -type ip -vlnv xilinx.com:ip:xlconcat:2.1 xlconcat_0
set_property -dict [list \
  CONFIG.NUM_PORTS 10 \
  CONFIG.IN4_WIDTH 1 \
  CONFIG.IN5_WIDTH 1 \
  CONFIG.IN7_WIDTH 4 \
  CONFIG.IN8_WIDTH 4 \
  CONFIG.IN9_WIDTH 4 \
] [get_bd_cells xlconcat_0]
create_bd_cell -type ip -vlnv xilinx.com:user:digital_recognition:1.0 digital_recognition_0

# ---- hierarchy /ov5640/LPR_PROJ/char_recgonize/char_2 ----
current_bd_instance /ov5640/LPR_PROJ/char_recgonize/char_2
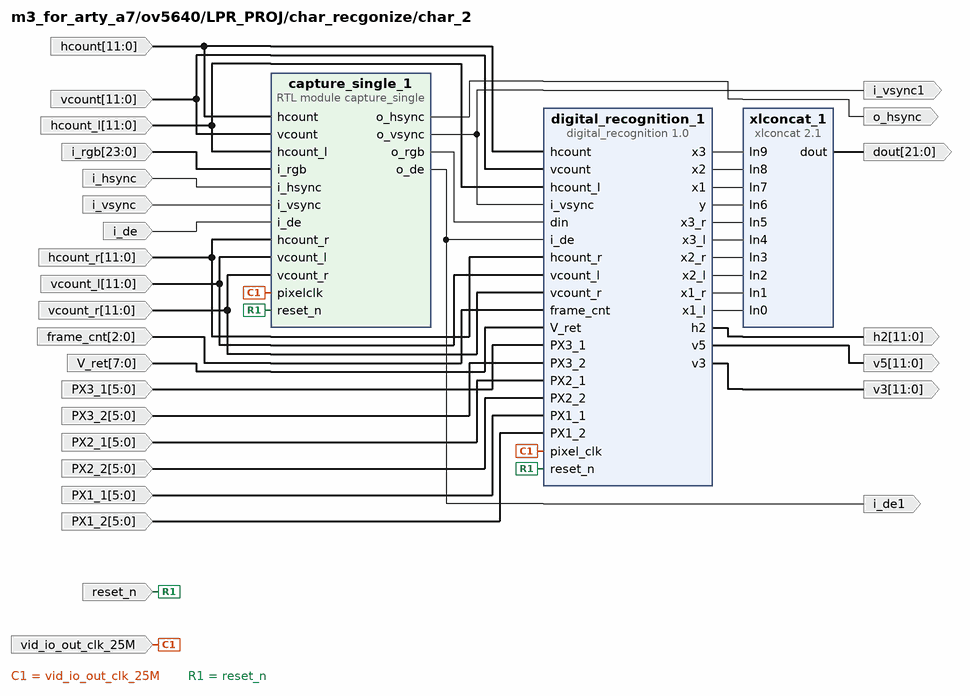
[diagram p9: block diagram inside /ov5640/LPR_PROJ/char_recgonize/char_2]
create_bd_pin -dir I -type clk vid_io_out_clk_25M
create_bd_pin -dir I -type rst reset_n
create_bd_pin -dir I -from 23 -to 0 i_rgb
create_bd_pin -dir I i_hsync
create_bd_pin -dir I i_vsync
create_bd_pin -dir I i_de
create_bd_pin -dir I -from 11 -to 0 hcount
create_bd_pin -dir I -from 11 -to 0 vcount
create_bd_pin -dir I -from 11 -to 0 hcount_l
create_bd_pin -dir I -from 11 -to 0 hcount_r
create_bd_pin -dir I -from 11 -to 0 vcount_l
create_bd_pin -dir I -from 11 -to 0 vcount_r
create_bd_pin -dir O o_hsync
create_bd_pin -dir O i_vsync1
create_bd_pin -dir O i_de1
create_bd_pin -dir I -from 2 -to 0 frame_cnt
create_bd_pin -dir O -from 11 -to 0 h2
create_bd_pin -dir O -from 11 -to 0 v5
create_bd_pin -dir O -from 11 -to 0 v3
create_bd_pin -dir I -from 7 -to 0 V_ret
create_bd_pin -dir I -from 5 -to 0 PX3_1
create_bd_pin -dir I -from 5 -to 0 PX3_2
create_bd_pin -dir I -from 5 -to 0 PX2_1
create_bd_pin -dir I -from 5 -to 0 PX2_2
create_bd_pin -dir I -from 5 -to 0 PX1_1
create_bd_pin -dir I -from 5 -to 0 PX1_2
create_bd_pin -dir O -from 21 -to 0 dout

create_bd_cell -type module -reference capture_single capture_single_1
create_bd_cell -type ip -vlnv xilinx.com:user:digital_recognition:1.0 digital_recognition_1
create_bd_cell -type ip -vlnv xilinx.com:ip:xlconcat:2.1 xlconcat_1
set_property -dict [list \
  CONFIG.NUM_PORTS 10 \
  CONFIG.IN4_WIDTH 1 \
  CONFIG.IN5_WIDTH 1 \
  CONFIG.IN7_WIDTH 4 \
  CONFIG.IN8_WIDTH 4 \
  CONFIG.IN9_WIDTH 4 \
] [get_bd_cells xlconcat_1]

# ---- hierarchy /ov5640/LPR_PROJ/char_recgonize/char_3 ----
current_bd_instance /ov5640/LPR_PROJ/char_recgonize/char_3
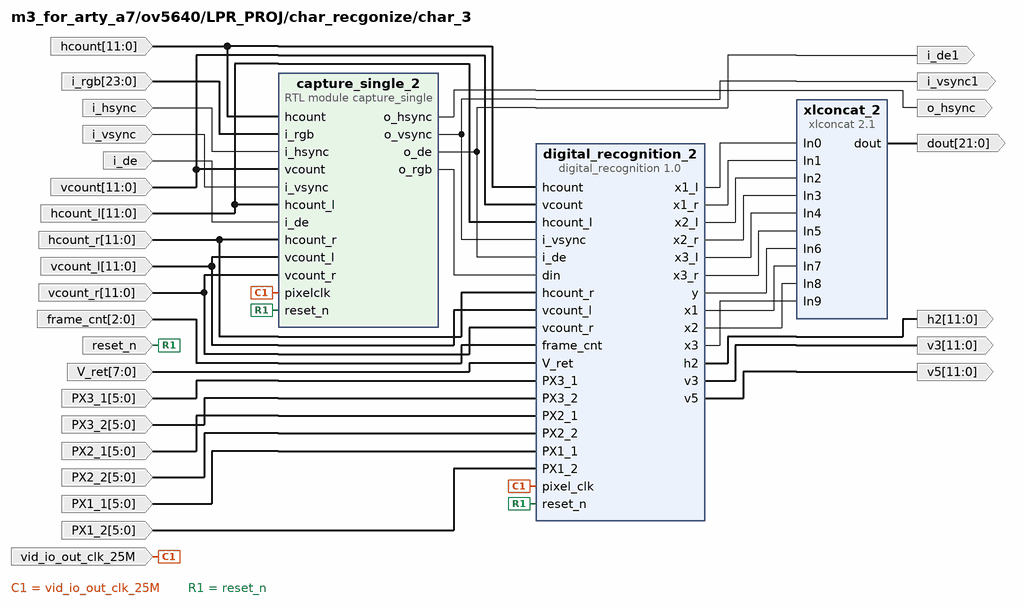
[diagram p10: block diagram inside /ov5640/LPR_PROJ/char_recgonize/char_3]
create_bd_pin -dir I -type clk vid_io_out_clk_25M
create_bd_pin -dir I -type rst reset_n
create_bd_pin -dir I -from 23 -to 0 i_rgb
create_bd_pin -dir I i_hsync
create_bd_pin -dir I i_vsync
create_bd_pin -dir I i_de
create_bd_pin -dir I -from 11 -to 0 hcount
create_bd_pin -dir I -from 11 -to 0 vcount
create_bd_pin -dir I -from 11 -to 0 hcount_l
create_bd_pin -dir I -from 11 -to 0 hcount_r
create_bd_pin -dir I -from 11 -to 0 vcount_l
create_bd_pin -dir I -from 11 -to 0 vcount_r
create_bd_pin -dir O o_hsync
create_bd_pin -dir O i_vsync1
create_bd_pin -dir O i_de1
create_bd_pin -dir I -from 2 -to 0 frame_cnt
create_bd_pin -dir O -from 11 -to 0 h2
create_bd_pin -dir O -from 11 -to 0 v5
create_bd_pin -dir O -from 11 -to 0 v3
create_bd_pin -dir I -from 7 -to 0 V_ret
create_bd_pin -dir I -from 5 -to 0 PX3_1
create_bd_pin -dir I -from 5 -to 0 PX3_2
create_bd_pin -dir I -from 5 -to 0 PX2_1
create_bd_pin -dir I -from 5 -to 0 PX2_2
create_bd_pin -dir I -from 5 -to 0 PX1_1
create_bd_pin -dir I -from 5 -to 0 PX1_2
create_bd_pin -dir O -from 21 -to 0 dout

create_bd_cell -type module -reference capture_single capture_single_2
create_bd_cell -type ip -vlnv xilinx.com:ip:xlconcat:2.1 xlconcat_2
set_property -dict [list \
  CONFIG.NUM_PORTS 10 \
  CONFIG.IN4_WIDTH 1 \
  CONFIG.IN5_WIDTH 1 \
  CONFIG.IN7_WIDTH 4 \
  CONFIG.IN8_WIDTH 4 \
  CONFIG.IN9_WIDTH 4 \
] [get_bd_cells xlconcat_2]
create_bd_cell -type ip -vlnv xilinx.com:user:digital_recognition:1.0 digital_recognition_2

# ---- hierarchy /ov5640/LPR_PROJ/char_recgonize/char_4 ----
current_bd_instance /ov5640/LPR_PROJ/char_recgonize/char_4
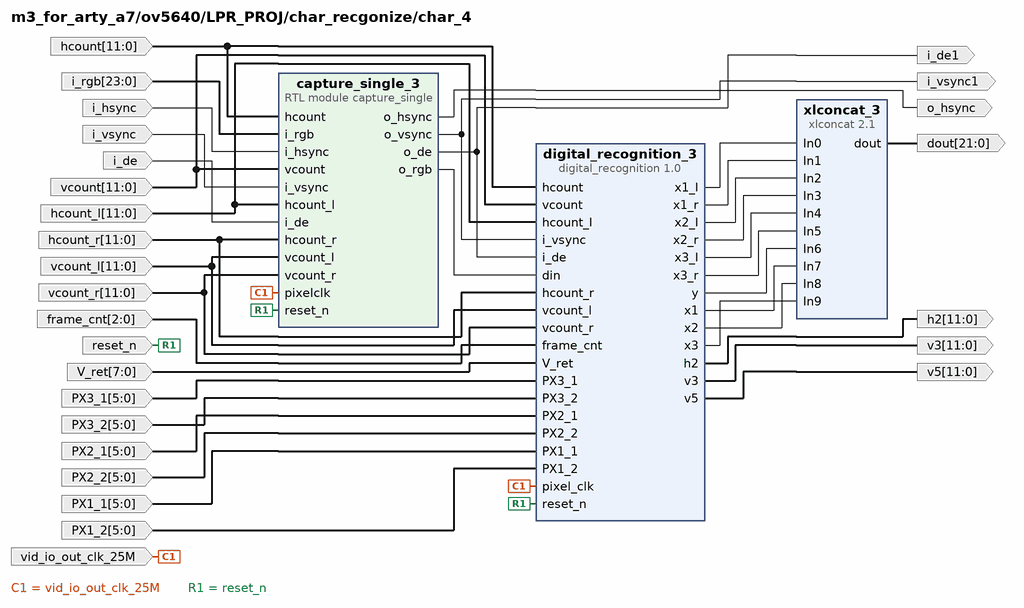
[diagram p11: block diagram inside /ov5640/LPR_PROJ/char_recgonize/char_4]
create_bd_pin -dir I -type clk vid_io_out_clk_25M
create_bd_pin -dir I -type rst reset_n
create_bd_pin -dir I -from 23 -to 0 i_rgb
create_bd_pin -dir I i_hsync
create_bd_pin -dir I i_vsync
create_bd_pin -dir I i_de
create_bd_pin -dir I -from 11 -to 0 hcount
create_bd_pin -dir I -from 11 -to 0 vcount
create_bd_pin -dir I -from 11 -to 0 hcount_l
create_bd_pin -dir I -from 11 -to 0 hcount_r
create_bd_pin -dir I -from 11 -to 0 vcount_l
create_bd_pin -dir I -from 11 -to 0 vcount_r
create_bd_pin -dir O o_hsync
create_bd_pin -dir O i_vsync1
create_bd_pin -dir O i_de1
create_bd_pin -dir I -from 2 -to 0 frame_cnt
create_bd_pin -dir O -from 11 -to 0 h2
create_bd_pin -dir O -from 11 -to 0 v5
create_bd_pin -dir O -from 11 -to 0 v3
create_bd_pin -dir I -from 7 -to 0 V_ret
create_bd_pin -dir I -from 5 -to 0 PX3_1
create_bd_pin -dir I -from 5 -to 0 PX3_2
create_bd_pin -dir I -from 5 -to 0 PX2_1
create_bd_pin -dir I -from 5 -to 0 PX2_2
create_bd_pin -dir I -from 5 -to 0 PX1_1
create_bd_pin -dir I -from 5 -to 0 PX1_2
create_bd_pin -dir O -from 21 -to 0 dout

create_bd_cell -type module -reference capture_single capture_single_3
create_bd_cell -type ip -vlnv xilinx.com:ip:xlconcat:2.1 xlconcat_3
set_property -dict [list \
  CONFIG.NUM_PORTS 10 \
  CONFIG.IN4_WIDTH 1 \
  CONFIG.IN5_WIDTH 1 \
  CONFIG.IN7_WIDTH 4 \
  CONFIG.IN8_WIDTH 4 \
  CONFIG.IN9_WIDTH 4 \
] [get_bd_cells xlconcat_3]
create_bd_cell -type ip -vlnv xilinx.com:user:digital_recognition:1.0 digital_recognition_3

# ---- hierarchy /ov5640/LPR_PROJ/char_recgonize/char_5 ----
current_bd_instance /ov5640/LPR_PROJ/char_recgonize/char_5
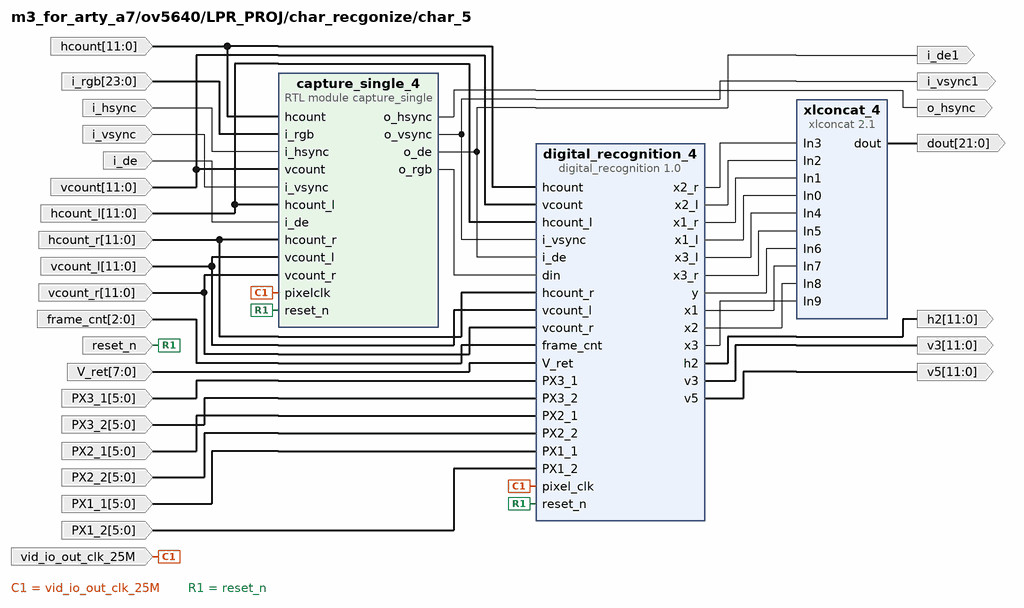
[diagram p12: block diagram inside /ov5640/LPR_PROJ/char_recgonize/char_5]
create_bd_pin -dir I -type clk vid_io_out_clk_25M
create_bd_pin -dir I -type rst reset_n
create_bd_pin -dir I -from 23 -to 0 i_rgb
create_bd_pin -dir I i_hsync
create_bd_pin -dir I i_vsync
create_bd_pin -dir I i_de
create_bd_pin -dir I -from 11 -to 0 hcount
create_bd_pin -dir I -from 11 -to 0 vcount
create_bd_pin -dir I -from 11 -to 0 hcount_l
create_bd_pin -dir I -from 11 -to 0 hcount_r
create_bd_pin -dir I -from 11 -to 0 vcount_l
create_bd_pin -dir I -from 11 -to 0 vcount_r
create_bd_pin -dir O o_hsync
create_bd_pin -dir O i_vsync1
create_bd_pin -dir O i_de1
create_bd_pin -dir I -from 2 -to 0 frame_cnt
create_bd_pin -dir O -from 11 -to 0 h2
create_bd_pin -dir O -from 11 -to 0 v5
create_bd_pin -dir O -from 11 -to 0 v3
create_bd_pin -dir I -from 7 -to 0 V_ret
create_bd_pin -dir I -from 5 -to 0 PX3_1
create_bd_pin -dir I -from 5 -to 0 PX3_2
create_bd_pin -dir I -from 5 -to 0 PX2_1
create_bd_pin -dir I -from 5 -to 0 PX2_2
create_bd_pin -dir I -from 5 -to 0 PX1_1
create_bd_pin -dir I -from 5 -to 0 PX1_2
create_bd_pin -dir O -from 21 -to 0 dout

create_bd_cell -type module -reference capture_single capture_single_4
create_bd_cell -type ip -vlnv xilinx.com:user:digital_recognition:1.0 digital_recognition_4
create_bd_cell -type ip -vlnv xilinx.com:ip:xlconcat:2.1 xlconcat_4
set_property -dict [list \
  CONFIG.NUM_PORTS 10 \
  CONFIG.IN4_WIDTH 1 \
  CONFIG.IN5_WIDTH 1 \
  CONFIG.IN7_WIDTH 4 \
  CONFIG.IN8_WIDTH 4 \
  CONFIG.IN9_WIDTH 4 \
] [get_bd_cells xlconcat_4]

# ---- hierarchy /ov5640/LPR_PROJ/swell_etch ----
current_bd_instance /ov5640/LPR_PROJ/swell_etch
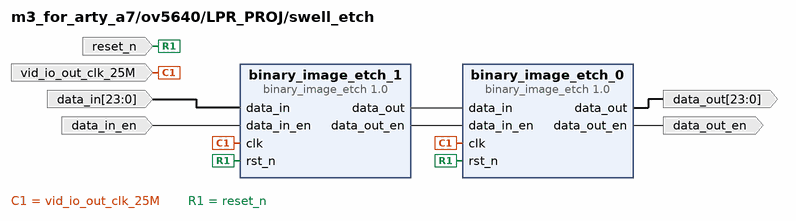
[diagram p13: block diagram inside /ov5640/LPR_PROJ/swell_etch]
create_bd_pin -dir I -type clk vid_io_out_clk_25M
create_bd_pin -dir I -type rst reset_n
create_bd_pin -dir I -from 23 -to 0 data_in
create_bd_pin -dir I data_in_en
create_bd_pin -dir O -from 23 -to 0 data_out
create_bd_pin -dir O data_out_en

create_bd_cell -type ip -vlnv xilinx.com:user:binary_image_etch:1.0 binary_image_etch_0
create_bd_cell -type ip -vlnv xilinx.com:user:binary_image_etch:1.0 binary_image_etch_1

# ---- connections ----

current_bd_instance /Clocks_and_Resets
connect_bd_net -net dcm_locked_1 [get_bd_pins clk_wiz_0/locked] \
  [get_bd_pins lock] [get_bd_pins proc_sys_reset_DAPLink/dcm_locked] [get_bd_pins proc_sys_reset_base/dcm_locked]
connect_bd_net [get_bd_pins aux_reset_in] [get_bd_pins proc_sys_reset_DAPLink/aux_reset_in]
connect_bd_net [get_bd_pins clk_wiz_0/clk_out1] \
  [get_bd_pins clk_cpu] [get_bd_pins proc_sys_reset_DAPLink/slowest_sync_clk] \
  [get_bd_pins proc_sys_reset_base/slowest_sync_clk]
connect_bd_net [get_bd_pins sys_clock] [get_bd_pins clk_wiz_0/clk_in1]
connect_bd_net [get_bd_pins proc_sys_reset_DAPLink/peripheral_aresetn] [get_bd_pins peripheral_aresetn1] [get_bd_pins i_peripheral_aresetn1/Op2]
connect_bd_net [get_bd_pins proc_sys_reset_DAPLink/interconnect_aresetn] [get_bd_pins i_interconnect_aresetn/Op2]
connect_bd_net [get_bd_pins proc_sys_reset_base/peripheral_aresetn] [get_bd_pins i_peripheral_aresetn1/Op1]
connect_bd_net [get_bd_pins proc_sys_reset_base/interconnect_aresetn] [get_bd_pins i_interconnect_aresetn/Op1]
connect_bd_net [get_bd_pins i_peripheral_aresetn1/Res] [get_bd_pins peripheral_aresetn]
connect_bd_net [get_bd_pins i_interconnect_aresetn/Res] [get_bd_pins interconnect_aresetn]
connect_bd_net [get_bd_pins proc_sys_reset_base/mb_reset] [get_bd_pins i_sysresetn_or/Op1] [get_bd_pins i_inv_dbgresetn/Op1]
connect_bd_net [get_bd_pins proc_sys_reset_DAPLink/mb_reset] [get_bd_pins i_sysresetn_or/Op2]
connect_bd_net [get_bd_pins i_inv_sysresetn1/Res] [get_bd_pins sysresetn]
connect_bd_net [get_bd_pins i_inv_dbgresetn/Res] [get_bd_pins dbgresetn]
connect_bd_net [get_bd_pins i_sysresetn_or/Res] [get_bd_pins i_inv_sysresetn1/Op1]
connect_bd_net -net xlconstant_0_dout [get_bd_pins xlconstant_1/dout] [get_bd_pins proc_sys_reset_DAPLink/ext_reset_in]
connect_bd_net [get_bd_pins clk_wiz_0/clk_out2] [get_bd_pins clk_qspi]
connect_bd_net [get_bd_pins sysresetreq] [get_bd_pins proc_sys_reset_DAPLink/mb_debug_sys_rst]
connect_bd_net [get_bd_pins sys_reset_n] [get_bd_pins proc_sys_reset_base/ext_reset_in]
connect_bd_net [get_bd_pins clk_wiz_0/clk_out3] [get_bd_pins clk_24]
connect_bd_net [get_bd_pins clk_wiz_0/clk_out4] [get_bd_pins clk_25]
connect_bd_net [get_bd_pins clk_wiz_0/clk_out5] [get_bd_pins clk_200]

current_bd_instance /daplink_if_0
connect_bd_intf_net [get_bd_intf_pins axi_quad_spi_0/SPI_0] [get_bd_intf_pins DAPLink_to_Arty_shield_0/QSPI]
connect_bd_intf_net [get_bd_intf_pins axi_single_spi_0/SPI_0] [get_bd_intf_pins DAPLink_to_Arty_shield_0/SPI]
connect_bd_intf_net [get_bd_intf_pins DAPLink_to_Arty_shield_0/QSPI_XIP] [get_bd_intf_pins axi_xip_quad_spi_0/SPI_0]
connect_bd_intf_net [get_bd_intf_pins axi_interconnect_0/M00_AXI] [get_bd_intf_pins axi_xip_quad_spi_0/AXI_LITE]
connect_bd_intf_net [get_bd_intf_pins axi_interconnect_0/M01_AXI] [get_bd_intf_pins axi_gpio_0/S_AXI]
connect_bd_intf_net [get_bd_intf_pins axi_interconnect_0/M02_AXI] [get_bd_intf_pins axi_single_spi_0/AXI_LITE]
connect_bd_intf_net [get_bd_intf_pins axi_interconnect_0/M03_AXI] [get_bd_intf_pins axi_quad_spi_0/AXI_LITE]
connect_bd_intf_net [get_bd_intf_pins axi_xip_quad_spi_0/AXI_FULL] [get_bd_intf_pins axi_protocol_convert_0/M_AXI]
connect_bd_intf_net [get_bd_intf_pins S_AXI] [get_bd_intf_pins axi_interconnect_0/S00_AXI]
connect_bd_intf_net [get_bd_intf_pins UART_out] [get_bd_intf_pins DAPLink_to_Arty_shield_0/UART_out]
connect_bd_intf_net [get_bd_intf_pins Shield_out] [get_bd_intf_pins DAPLink_to_Arty_shield_0/shield]
connect_bd_intf_net [get_bd_intf_pins C_AXI] [get_bd_intf_pins axi_protocol_convert_0/S_AXI]
connect_bd_intf_net [get_bd_intf_pins M04_AXI] [get_bd_intf_pins axi_interconnect_0/M04_AXI]
connect_bd_net [get_bd_pins s_axi_aclk] \
  [get_bd_pins axi_single_spi_0/s_axi_aclk] [get_bd_pins axi_quad_spi_0/s_axi_aclk] \
  [get_bd_pins axi_xip_quad_spi_0/s_axi_aclk] [get_bd_pins axi_gpio_0/s_axi_aclk] \
  [get_bd_pins axi_xip_quad_spi_0/s_axi4_aclk] [get_bd_pins axi_protocol_convert_0/aclk] \
  [get_bd_pins axi_interconnect_0/ACLK] [get_bd_pins axi_interconnect_0/S00_ACLK] [get_bd_pins axi_interconnect_0/M00_ACLK] \
  [get_bd_pins axi_interconnect_0/M01_ACLK] [get_bd_pins axi_interconnect_0/M02_ACLK] \
  [get_bd_pins axi_interconnect_0/M03_ACLK] [get_bd_pins axi_interconnect_0/M04_ACLK]
connect_bd_net [get_bd_pins s_axi_aresetn] \
  [get_bd_pins axi_single_spi_0/s_axi_aresetn] [get_bd_pins axi_quad_spi_0/s_axi_aresetn] \
  [get_bd_pins axi_xip_quad_spi_0/s_axi_aresetn] [get_bd_pins axi_gpio_0/s_axi_aresetn] \
  [get_bd_pins axi_xip_quad_spi_0/s_axi4_aresetn] [get_bd_pins axi_protocol_convert_0/aresetn] \
  [get_bd_pins axi_interconnect_0/ARESETN] [get_bd_pins axi_interconnect_0/S00_ARESETN] \
  [get_bd_pins axi_interconnect_0/M00_ARESETN] [get_bd_pins axi_interconnect_0/M01_ARESETN] \
  [get_bd_pins axi_interconnect_0/M02_ARESETN] [get_bd_pins axi_interconnect_0/M03_ARESETN]
connect_bd_net -net DAPLink_to_Arty_shie_1_DAPLink_fittedn [get_bd_pins DAPLink_to_Arty_shield_0/DAPLink_fittedn] [get_bd_pins DAPLink_fittedn]
connect_bd_net -net DAPLink_to_Arty_shie_1_uart_rxd_axi [get_bd_pins DAPLink_to_Arty_shield_0/uart_rxd_axi] [get_bd_pins uart_rxd_axi]
connect_bd_net -net DAPLink_to_Arty_shie_1_SWDI [get_bd_pins DAPLink_to_Arty_shield_0/SWDI] [get_bd_pins SWDI]
connect_bd_net -net DAPLink_to_Arty_shie_1_SWCLK [get_bd_pins DAPLink_to_Arty_shield_0/SWCLK] [get_bd_pins SWCLK]
connect_bd_net -net DAPLink_to_Arty_shie_1_SWRSTn [get_bd_pins DAPLink_to_Arty_shield_0/SWRSTn] [get_bd_pins nSRST]
connect_bd_net [get_bd_pins uart_txd_axi] [get_bd_pins DAPLink_to_Arty_shield_0/uart_txd_axi]
connect_bd_net [get_bd_pins ext_spi_clk] \
  [get_bd_pins axi_single_spi_0/ext_spi_clk] [get_bd_pins axi_quad_spi_0/ext_spi_clk] \
  [get_bd_pins axi_xip_quad_spi_0/ext_spi_clk] [get_bd_pins DAPLink_to_Arty_shield_0/ext_spi_clk]
connect_bd_net -net axi_quad_spi_1_ip2intc_irpt [get_bd_pins axi_quad_spi_0/ip2intc_irpt] [get_bd_pins qspi_irq]
connect_bd_net [get_bd_pins axi_single_spi_0/ip2intc_irpt] [get_bd_pins spi_irq]
connect_bd_net [get_bd_pins axi_gpio_0/gpio_io_o] [get_bd_pins DAPLink_to_Arty_shield_0/qspi_sel]
connect_bd_net [get_bd_pins axi_xip_quad_spi_0/ip2intc_irpt] [get_bd_pins qspi_xip_irq]
connect_bd_net [get_bd_pins SWDO] [get_bd_pins DAPLink_to_Arty_shield_0/SWDO]
connect_bd_net [get_bd_pins SWDOEN] [get_bd_pins DAPLink_to_Arty_shield_0/SWDOEN]
connect_bd_net [get_bd_pins M04_ARESETN] [get_bd_pins axi_interconnect_0/M04_ARESETN]

current_bd_instance /ov5640
connect_bd_intf_net [get_bd_intf_pins smartconnect_0/M00_AXI] [get_bd_intf_pins mig_7series_0/S_AXI]
connect_bd_intf_net [get_bd_intf_pins axi_vdma_0/M_AXI_MM2S] [get_bd_intf_pins smartconnect_0/S00_AXI]
connect_bd_intf_net [get_bd_intf_pins axi_vdma_0/M_AXI_S2MM] [get_bd_intf_pins smartconnect_0/S01_AXI]
connect_bd_intf_net [get_bd_intf_pins v_vid_in_axi4s_0/video_out] [get_bd_intf_pins axi_vdma_0/S_AXIS_S2MM]
connect_bd_intf_net [get_bd_intf_pins v_tc_0/vtiming_out] [get_bd_intf_pins v_axi4s_vid_out_0/vtiming_in]
connect_bd_intf_net [get_bd_intf_pins axi_vdma_0/M_AXIS_MM2S] [get_bd_intf_pins v_axi4s_vid_out_0/video_in]
connect_bd_intf_net [get_bd_intf_pins S_AXI_LITE_0] [get_bd_intf_pins axi_vdma_0/S_AXI_LITE]
connect_bd_intf_net [get_bd_intf_pins DDR2_0] [get_bd_intf_pins mig_7series_0/DDR2]
connect_bd_intf_net [get_bd_intf_pins S02_AXI_0] [get_bd_intf_pins smartconnect_0/S02_AXI]
connect_bd_intf_net [get_bd_intf_pins S_AXI_0] [get_bd_intf_pins LPR_PROJ/S_AXI_0]
connect_bd_intf_net [get_bd_intf_pins S00_AXI1] [get_bd_intf_pins LPR_PROJ/S00_AXI1]
connect_bd_intf_net [get_bd_intf_pins S00_AXI] [get_bd_intf_pins LPR_PROJ/S00_AXI]
connect_bd_intf_net [get_bd_intf_pins S00_AXI2] [get_bd_intf_pins LPR_PROJ/S00_AXI2]
connect_bd_net [get_bd_pins proc_sys_reset_0/peripheral_aresetn] \
  [get_bd_pins mig_7series_0/aresetn] [get_bd_pins smartconnect_0/aresetn] [get_bd_pins I2C_OV5640_Init_RGB5_0/rst_n] \
  [get_bd_pins LPR_PROJ/reset_n]
connect_bd_net [get_bd_pins OV_Sensor_ML_2/rgb_o] [get_bd_pins v_vid_in_axi4s_0/vid_data]
connect_bd_net [get_bd_pins OV_Sensor_ML_2/hs_o] [get_bd_pins v_vid_in_axi4s_0/vid_active_video] [get_bd_pins v_vid_in_axi4s_0/vid_hsync]
connect_bd_net [get_bd_pins OV_Sensor_ML_2/vs_o] [get_bd_pins v_vid_in_axi4s_0/vid_vsync]
connect_bd_net [get_bd_pins OV_Sensor_ML_2/vid_clk_ce] [get_bd_pins v_vid_in_axi4s_0/vid_io_in_ce]
connect_bd_net [get_bd_pins OV_Sensor_ML_2/cmos_xclk_o] [get_bd_pins cmos_xclk_o_0]
connect_bd_net -net CLK_i_0_1 [get_bd_pins CLK_i_24M] [get_bd_pins OV_Sensor_ML_2/CLK_i]
connect_bd_net -net cmos_data_i_0_1 [get_bd_pins cmos_data_i_0] [get_bd_pins OV_Sensor_ML_2/cmos_data_i]
connect_bd_net -net cmos_href_i_0_1 [get_bd_pins cmos_href_i_0] [get_bd_pins OV_Sensor_ML_2/cmos_href_i]
connect_bd_net -net cmos_pclk_i_0_1 [get_bd_pins cmos_pclk_i_0] [get_bd_pins v_vid_in_axi4s_0/vid_io_in_clk] [get_bd_pins OV_Sensor_ML_2/cmos_pclk_i]
connect_bd_net -net cmos_vsync_i_0_1 [get_bd_pins cmos_vsync_i_0] [get_bd_pins OV_Sensor_ML_2/cmos_vsync_i]
connect_bd_net -net aclk_0_1 [get_bd_pins aclk_200M] \
  [get_bd_pins v_vid_in_axi4s_0/aclk] [get_bd_pins axi_vdma_0/m_axis_mm2s_aclk] [get_bd_pins axi_vdma_0/s_axis_s2mm_aclk] \
  [get_bd_pins v_axi4s_vid_out_0/aclk] [get_bd_pins mig_7series_0/sys_clk_i]
connect_bd_net [get_bd_pins xlconstant_0/dout] [get_bd_pins v_axi4s_vid_out_0/fid]
connect_bd_net [get_bd_pins LOCK] \
  [get_bd_pins v_vid_in_axi4s_0/axis_enable] [get_bd_pins v_vid_in_axi4s_0/aresetn] [get_bd_pins v_vid_in_axi4s_0/aclken] \
  [get_bd_pins v_tc_0/resetn] [get_bd_pins v_tc_0/clken] [get_bd_pins v_axi4s_vid_out_0/vid_io_out_ce] \
  [get_bd_pins v_axi4s_vid_out_0/aclken] [get_bd_pins v_axi4s_vid_out_0/aresetn]
connect_bd_net -net vid_io_out_clk_0_1 [get_bd_pins vid_io_out_clk_25M] \
  [get_bd_pins v_axi4s_vid_out_0/vid_io_out_clk] [get_bd_pins v_tc_0/clk] [get_bd_pins rgb2vga_0/PixelClk] \
  [get_bd_pins I2C_OV5640_Init_RGB5_0/clk] [get_bd_pins LPR_PROJ/vid_io_out_clk_25M]
connect_bd_net -net s_axi_lite_aclk_0_1 [get_bd_pins s_axi_lite_aclk_0] \
  [get_bd_pins axi_vdma_0/s_axi_lite_aclk] [get_bd_pins smartconnect_0/aclk1] [get_bd_pins LPR_PROJ/clk_cpu]
connect_bd_net [get_bd_pins mig_7series_0/ui_clk] \
  [get_bd_pins axi_vdma_0/m_axi_mm2s_aclk] [get_bd_pins proc_sys_reset_0/slowest_sync_clk] \
  [get_bd_pins axi_vdma_0/m_axi_s2mm_aclk] [get_bd_pins smartconnect_0/aclk]
connect_bd_net [get_bd_pins rgb2vga_0/vga_pHSync] [get_bd_pins vga_pHSync_0]
connect_bd_net [get_bd_pins rgb2vga_0/vga_pVSync] [get_bd_pins vga_pVSync_0]
connect_bd_net [get_bd_pins rgb2vga_0/vga_pRed] [get_bd_pins vga_pRed_1]
connect_bd_net [get_bd_pins rgb2vga_0/vga_pGreen] [get_bd_pins vga_pGreen_1]
connect_bd_net [get_bd_pins rgb2vga_0/vga_pBlue] [get_bd_pins vga_pBlue_1]
connect_bd_net [get_bd_pins mig_7series_0/mmcm_locked] [get_bd_pins proc_sys_reset_0/dcm_locked]
connect_bd_net [get_bd_pins mig_7series_0/ui_clk_sync_rst] [get_bd_pins proc_sys_reset_0/ext_reset_in]
connect_bd_net [get_bd_pins v_axi4s_vid_out_0/vtg_ce] [get_bd_pins v_tc_0/gen_clken]
connect_bd_net [get_bd_pins xlconstant_2/dout] [get_bd_pins dout_0]
connect_bd_net -net axi_resetn_0_1 [get_bd_pins axi_resetn_0] [get_bd_pins axi_vdma_0/axi_resetn]
connect_bd_net -net sys_rst_0_1 [get_bd_pins sys_rst_0] [get_bd_pins mig_7series_0/sys_rst]
connect_bd_net [get_bd_pins I2C_OV5640_Init_RGB5_0/i2c_sclk] [get_bd_pins i2c_sclk_0]
connect_bd_net [get_bd_pins i2c_sdat_0] [get_bd_pins I2C_OV5640_Init_RGB5_0/i2c_sdat]
connect_bd_net [get_bd_pins proc_sys_reset_0/peripheral_reset] \
  [get_bd_pins v_vid_in_axi4s_0/vid_io_in_reset] [get_bd_pins v_axi4s_vid_out_0/vid_io_out_reset]
connect_bd_net [get_bd_pins LPR_PROJ/o_rgb] [get_bd_pins rgb2vga_0/rgb_pData]
connect_bd_net [get_bd_pins v_axi4s_vid_out_0/vid_vsync] [get_bd_pins LPR_PROJ/i_v_sync]
connect_bd_net [get_bd_pins LPR_PROJ/o_h_sync] [get_bd_pins rgb2vga_0/rgb_pHSync]
connect_bd_net [get_bd_pins v_axi4s_vid_out_0/vid_hsync] [get_bd_pins LPR_PROJ/i_h_sync]
connect_bd_net [get_bd_pins v_axi4s_vid_out_0/vid_data] [get_bd_pins LPR_PROJ/rgb_in]
connect_bd_net [get_bd_pins v_axi4s_vid_out_0/vid_active_video] [get_bd_pins LPR_PROJ/i_data_en]
connect_bd_net [get_bd_pins LPR_PROJ/o_v_sync] [get_bd_pins rgb2vga_0/rgb_pVSync]
connect_bd_net [get_bd_pins LPR_PROJ/o_de] [get_bd_pins rgb2vga_0/rgb_pVDE]
connect_bd_net -net switch_0_1 [get_bd_pins switch_0] [get_bd_pins LPR_PROJ/switch_0]
connect_bd_net -net s_axi_aclk_0_1 [get_bd_pins s_axi_aclk_0] [get_bd_pins LPR_PROJ/s_axi_aclk_0]
connect_bd_net -net s_axi_aresetn_0_1 [get_bd_pins s_axi_aresetn_0] [get_bd_pins LPR_PROJ/s_axi_aresetn_0]
connect_bd_net [get_bd_pins s00_axi_aresetn] [get_bd_pins LPR_PROJ/s00_axi_aresetn]

current_bd_instance /ov5640/LPR_PROJ
connect_bd_intf_net [get_bd_intf_pins S_AXI_0] [get_bd_intf_pins axi_gpio_0/S_AXI]
connect_bd_intf_net [get_bd_intf_pins S00_AXI1] [get_bd_intf_pins char_recgonize/S00_AXI1]
connect_bd_intf_net [get_bd_intf_pins S00_AXI] [get_bd_intf_pins char_recgonize/S00_AXI]
connect_bd_intf_net [get_bd_intf_pins S00_AXI2] [get_bd_intf_pins Hcount_Send_0/S00_AXI]
connect_bd_net [get_bd_pins rgb_change_0/rgb_out] [get_bd_pins rgb2ycbcr_0/i_rgb]
connect_bd_net [get_bd_pins sync_change_0/o_h_sync] [get_bd_pins rgb2ycbcr_0/i_h_sync]
connect_bd_net [get_bd_pins sync_change_0/o_v_sync] [get_bd_pins rgb2ycbcr_0/i_v_sync]
connect_bd_net [get_bd_pins rgb2ycbcr_0/o_rgb] [get_bd_pins car_id_0/i_rgb] [get_bd_pins rgb_mux_0/i_rgb_0] [get_bd_pins capture_lpr_0/i_rgb]
connect_bd_net [get_bd_pins rgb2ycbcr_0/o_ycbcr] [get_bd_pins car_id_0/i_ycbcr] [get_bd_pins rgb_mux_0/i_rgb_1]
connect_bd_net [get_bd_pins rgb2ycbcr_0/o_gray] [get_bd_pins car_id_0/i_gray]
connect_bd_net [get_bd_pins rgb2ycbcr_0/o_h_sync] [get_bd_pins car_id_0/i_h_sync]
connect_bd_net [get_bd_pins rgb2ycbcr_0/o_v_sync] [get_bd_pins car_id_0/i_v_sync]
connect_bd_net [get_bd_pins rgb2ycbcr_0/o_data_en] [get_bd_pins car_id_0/i_de]
connect_bd_net [get_bd_pins i_data_en] [get_bd_pins rgb2ycbcr_0/i_data_en]
connect_bd_net [get_bd_pins rgb_in] [get_bd_pins rgb_change_0/rgb_in]
connect_bd_net [get_bd_pins i_h_sync] [get_bd_pins sync_change_0/i_h_sync]
connect_bd_net [get_bd_pins i_v_sync] [get_bd_pins sync_change_0/i_v_sync]
connect_bd_net [get_bd_pins vid_io_out_clk_25M] \
  [get_bd_pins HVcount_0/pixelclk] [get_bd_pins rgb2ycbcr_0/clk] [get_bd_pins car_id_0/pix_clk] \
  [get_bd_pins capture_lpr_0/pixelclk] [get_bd_pins rgb2ycbcr_1/clk] [get_bd_pins ycbcr_location_0/pixelclk] \
  [get_bd_pins display_0/pixelclk] [get_bd_pins Vertical_Projection8_0/pixelclk] [get_bd_pins HVcount_1/pixelclk] \
  [get_bd_pins binary_image_swell_0/clk] [get_bd_pins char_recgonize/vid_io_out_clk_25M] \
  [get_bd_pins swell_etch/vid_io_out_clk_25M] [get_bd_pins binary_image_etch_0/clk] \
  [get_bd_pins Vertical_Projection_0/pixelclk]
connect_bd_net [get_bd_pins reset_n] \
  [get_bd_pins HVcount_0/reset_n] [get_bd_pins car_id_0/reset_n] [get_bd_pins capture_lpr_0/reset_n] \
  [get_bd_pins ycbcr_location_0/reset_n] [get_bd_pins display_0/reset_n] [get_bd_pins Vertical_Projection8_0/reset_n] \
  [get_bd_pins HVcount_1/reset_n] [get_bd_pins binary_image_swell_0/rst_n] [get_bd_pins char_recgonize/reset_n] \
  [get_bd_pins swell_etch/reset_n] [get_bd_pins binary_image_etch_0/rst_n] [get_bd_pins Vertical_Projection_0/reset_n]
connect_bd_net [get_bd_pins car_id_0/o_h_sync] [get_bd_pins HVcount_0/i_hsync]
connect_bd_net [get_bd_pins car_id_0/o_v_sync] [get_bd_pins HVcount_0/i_vsync]
connect_bd_net [get_bd_pins HVcount_0/hcount] [get_bd_pins capture_lpr_0/hcount] [get_bd_pins Vertical_Projection_0/i_hcount]
connect_bd_net [get_bd_pins HVcount_0/vcount] [get_bd_pins capture_lpr_0/vcount] [get_bd_pins Vertical_Projection_0/i_vcount]
connect_bd_net [get_bd_pins HVcount_0/o_data] [get_bd_pins Vertical_Projection_0/i_binary]
connect_bd_net [get_bd_pins HVcount_0/o_hsync] [get_bd_pins capture_lpr_0/i_hsync] [get_bd_pins Vertical_Projection_0/i_hs]
connect_bd_net [get_bd_pins HVcount_0/o_vsync] [get_bd_pins capture_lpr_0/i_vsync] [get_bd_pins Vertical_Projection_0/i_vs]
connect_bd_net [get_bd_pins HVcount_0/o_de] [get_bd_pins capture_lpr_0/i_de] [get_bd_pins Vertical_Projection_0/i_de]
connect_bd_net [get_bd_pins Vertical_Projection_0/hcount_l] [get_bd_pins capture_lpr_0/hcount_l]
connect_bd_net [get_bd_pins Vertical_Projection_0/hcount_r] [get_bd_pins capture_lpr_0/hcount_r]
connect_bd_net [get_bd_pins Vertical_Projection_0/vcount_l] [get_bd_pins capture_lpr_0/vcount_l]
connect_bd_net [get_bd_pins Vertical_Projection_0/vcount_r] [get_bd_pins capture_lpr_0/vcount_r]
connect_bd_net [get_bd_pins capture_lpr_0/o_rgb] [get_bd_pins rgb2ycbcr_1/i_rgb] [get_bd_pins rgb_mux_0/i_rgb_3]
connect_bd_net [get_bd_pins capture_lpr_0/o_hsync] [get_bd_pins rgb2ycbcr_1/i_h_sync]
connect_bd_net [get_bd_pins capture_lpr_0/o_vsync] [get_bd_pins rgb2ycbcr_1/i_v_sync]
connect_bd_net [get_bd_pins capture_lpr_0/o_de] [get_bd_pins rgb2ycbcr_1/i_data_en]
connect_bd_net [get_bd_pins rgb2ycbcr_1/o_rgb] [get_bd_pins ycbcr_location_0/i_rgb]
connect_bd_net [get_bd_pins rgb2ycbcr_1/o_ycbcr] [get_bd_pins ycbcr_location_0/i_ycbcr] [get_bd_pins rgb_mux_0/i_rgb_4]
connect_bd_net [get_bd_pins rgb2ycbcr_1/o_gray] [get_bd_pins ycbcr_location_0/i_gray]
connect_bd_net [get_bd_pins rgb2ycbcr_1/o_h_sync] [get_bd_pins ycbcr_location_0/i_hsync]
connect_bd_net [get_bd_pins rgb2ycbcr_1/o_v_sync] [get_bd_pins ycbcr_location_0/i_vsync]
connect_bd_net [get_bd_pins rgb2ycbcr_1/o_data_en] [get_bd_pins ycbcr_location_0/i_de]
connect_bd_net [get_bd_pins ycbcr_location_0/binary_image] [get_bd_pins rgb_mux_0/i_rgb_5] [get_bd_pins swell_etch/data_in]
connect_bd_net [get_bd_pins HVcount_1/o_data] \
  [get_bd_pins Vertical_Projection8_0/i_binary] [get_bd_pins display_0/i_rgb] [get_bd_pins char_recgonize/i_rgb]
connect_bd_net [get_bd_pins HVcount_1/o_hsync] \
  [get_bd_pins display_0/i_hsync] [get_bd_pins Vertical_Projection8_0/i_hs] [get_bd_pins char_recgonize/i_hsync]
connect_bd_net [get_bd_pins HVcount_1/o_vsync] \
  [get_bd_pins display_0/i_vsync] [get_bd_pins Vertical_Projection8_0/i_vs] [get_bd_pins char_recgonize/i_vsync]
connect_bd_net [get_bd_pins HVcount_1/o_de] [get_bd_pins display_0/i_de] [get_bd_pins Vertical_Projection8_0/i_de] [get_bd_pins char_recgonize/i_de]
connect_bd_net [get_bd_pins HVcount_1/hcount] \
  [get_bd_pins display_0/hcount] [get_bd_pins Vertical_Projection8_0/i_hcount] [get_bd_pins char_recgonize/hcount]
connect_bd_net [get_bd_pins Vertical_Projection8_0/hcount_l1] [get_bd_pins display_0/hcount_l1]
connect_bd_net [get_bd_pins Vertical_Projection8_0/hcount_r1] [get_bd_pins display_0/hcount_r1]
connect_bd_net [get_bd_pins Vertical_Projection8_0/hcount_l2] [get_bd_pins display_0/hcount_l2]
connect_bd_net [get_bd_pins Vertical_Projection8_0/hcount_r2] [get_bd_pins display_0/hcount_r2]
connect_bd_net [get_bd_pins Vertical_Projection8_0/hcount_l3] [get_bd_pins display_0/hcount_l3]
connect_bd_net [get_bd_pins Vertical_Projection8_0/hcount_r3] [get_bd_pins display_0/hcount_r3]
connect_bd_net [get_bd_pins Vertical_Projection8_0/hcount_l5] \
  [get_bd_pins display_0/hcount_l5] [get_bd_pins Hcount_Send_0/hcount2_l] [get_bd_pins char_recgonize/hcount_l_0]
connect_bd_net [get_bd_pins Vertical_Projection8_0/hcount_r5] \
  [get_bd_pins display_0/hcount_r5] [get_bd_pins Hcount_Send_0/hcount2_r] [get_bd_pins char_recgonize/hcount_r_0]
connect_bd_net [get_bd_pins Vertical_Projection8_0/hcount_l6] \
  [get_bd_pins display_0/hcount_l6] [get_bd_pins Hcount_Send_0/hcount3_l] [get_bd_pins char_recgonize/hcount_l_3]
connect_bd_net [get_bd_pins Vertical_Projection8_0/hcount_r6] \
  [get_bd_pins display_0/hcount_r6] [get_bd_pins Hcount_Send_0/hcount3_r] [get_bd_pins char_recgonize/hcount_r_3]
connect_bd_net [get_bd_pins Vertical_Projection8_0/hcount_l7] \
  [get_bd_pins display_0/hcount_l7] [get_bd_pins Hcount_Send_0/hcount4_l] [get_bd_pins char_recgonize/hcount_l_5]
connect_bd_net [get_bd_pins Vertical_Projection8_0/hcount_r7] \
  [get_bd_pins display_0/hcount_r7] [get_bd_pins Hcount_Send_0/hcount4_r] [get_bd_pins char_recgonize/hcount_r_5]
connect_bd_net [get_bd_pins Vertical_Projection8_0/hcount_l8] \
  [get_bd_pins display_0/hcount_l8] [get_bd_pins Hcount_Send_0/hcount5_l] [get_bd_pins char_recgonize/hcount_l_7]
connect_bd_net [get_bd_pins Vertical_Projection8_0/hcount_r8] \
  [get_bd_pins display_0/hcount_r8] [get_bd_pins Hcount_Send_0/hcount5_r] [get_bd_pins char_recgonize/hcount_r_7]
connect_bd_net [get_bd_pins Vertical_Projection8_0/vcount_l] [get_bd_pins display_0/vcount_l] [get_bd_pins char_recgonize/vcount_l]
connect_bd_net [get_bd_pins Vertical_Projection8_0/vcount_r] [get_bd_pins display_0/vcount_r] [get_bd_pins char_recgonize/vcount_r]
